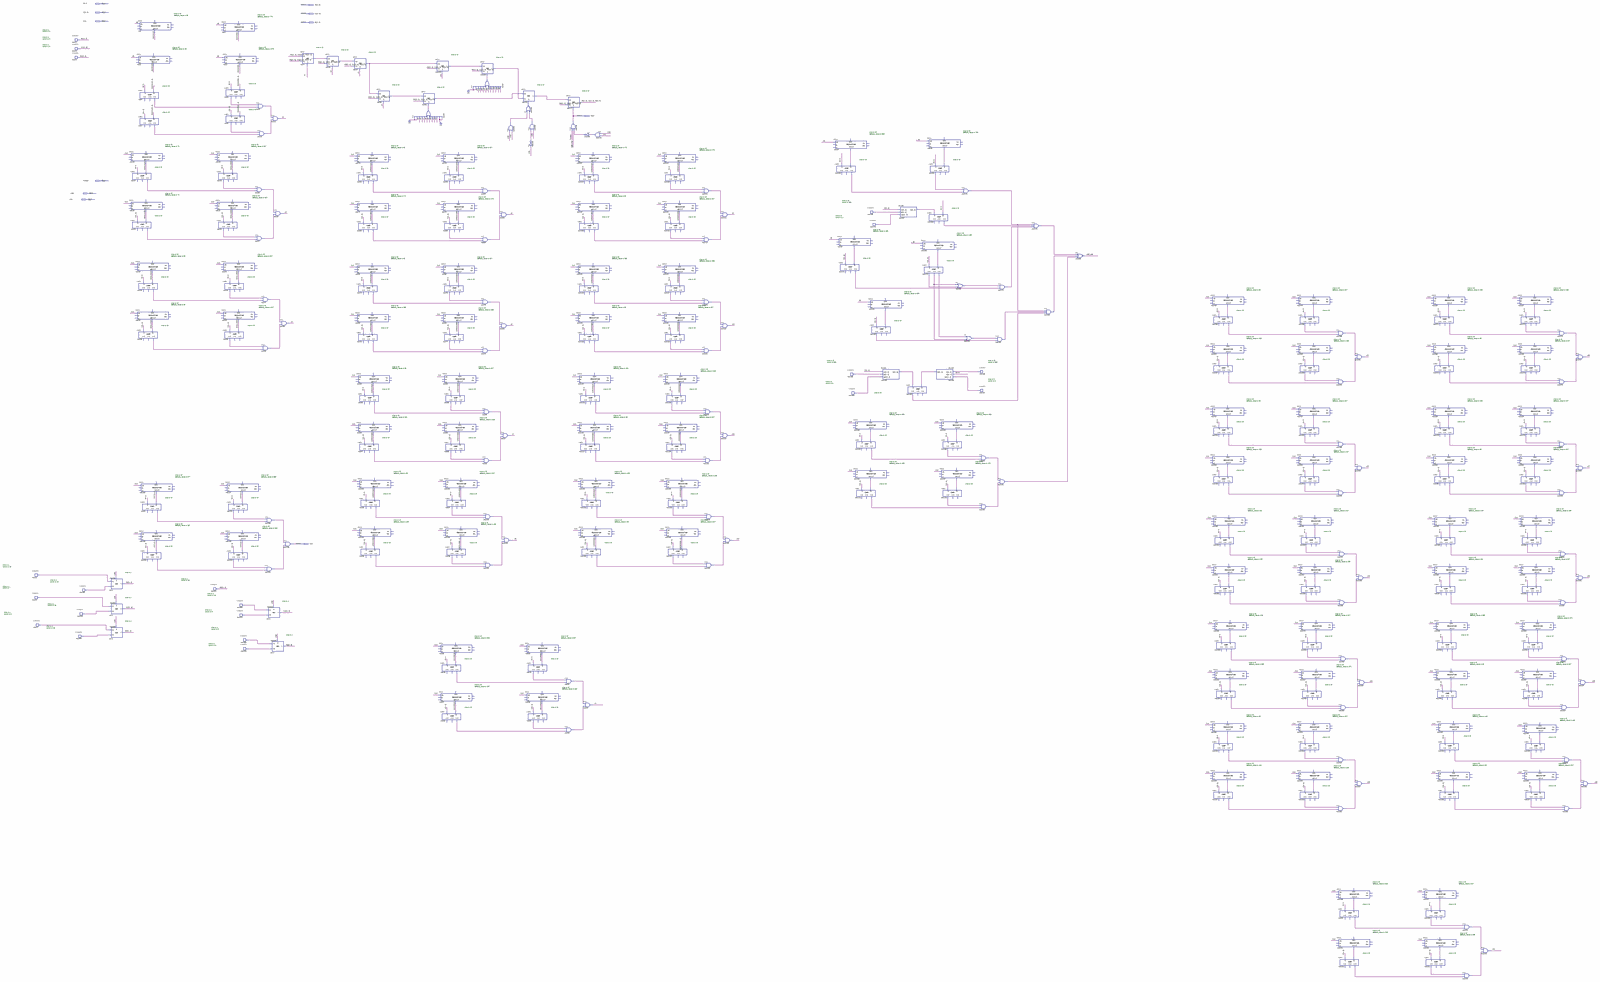
[diagram p0: schematic sheet, whole]
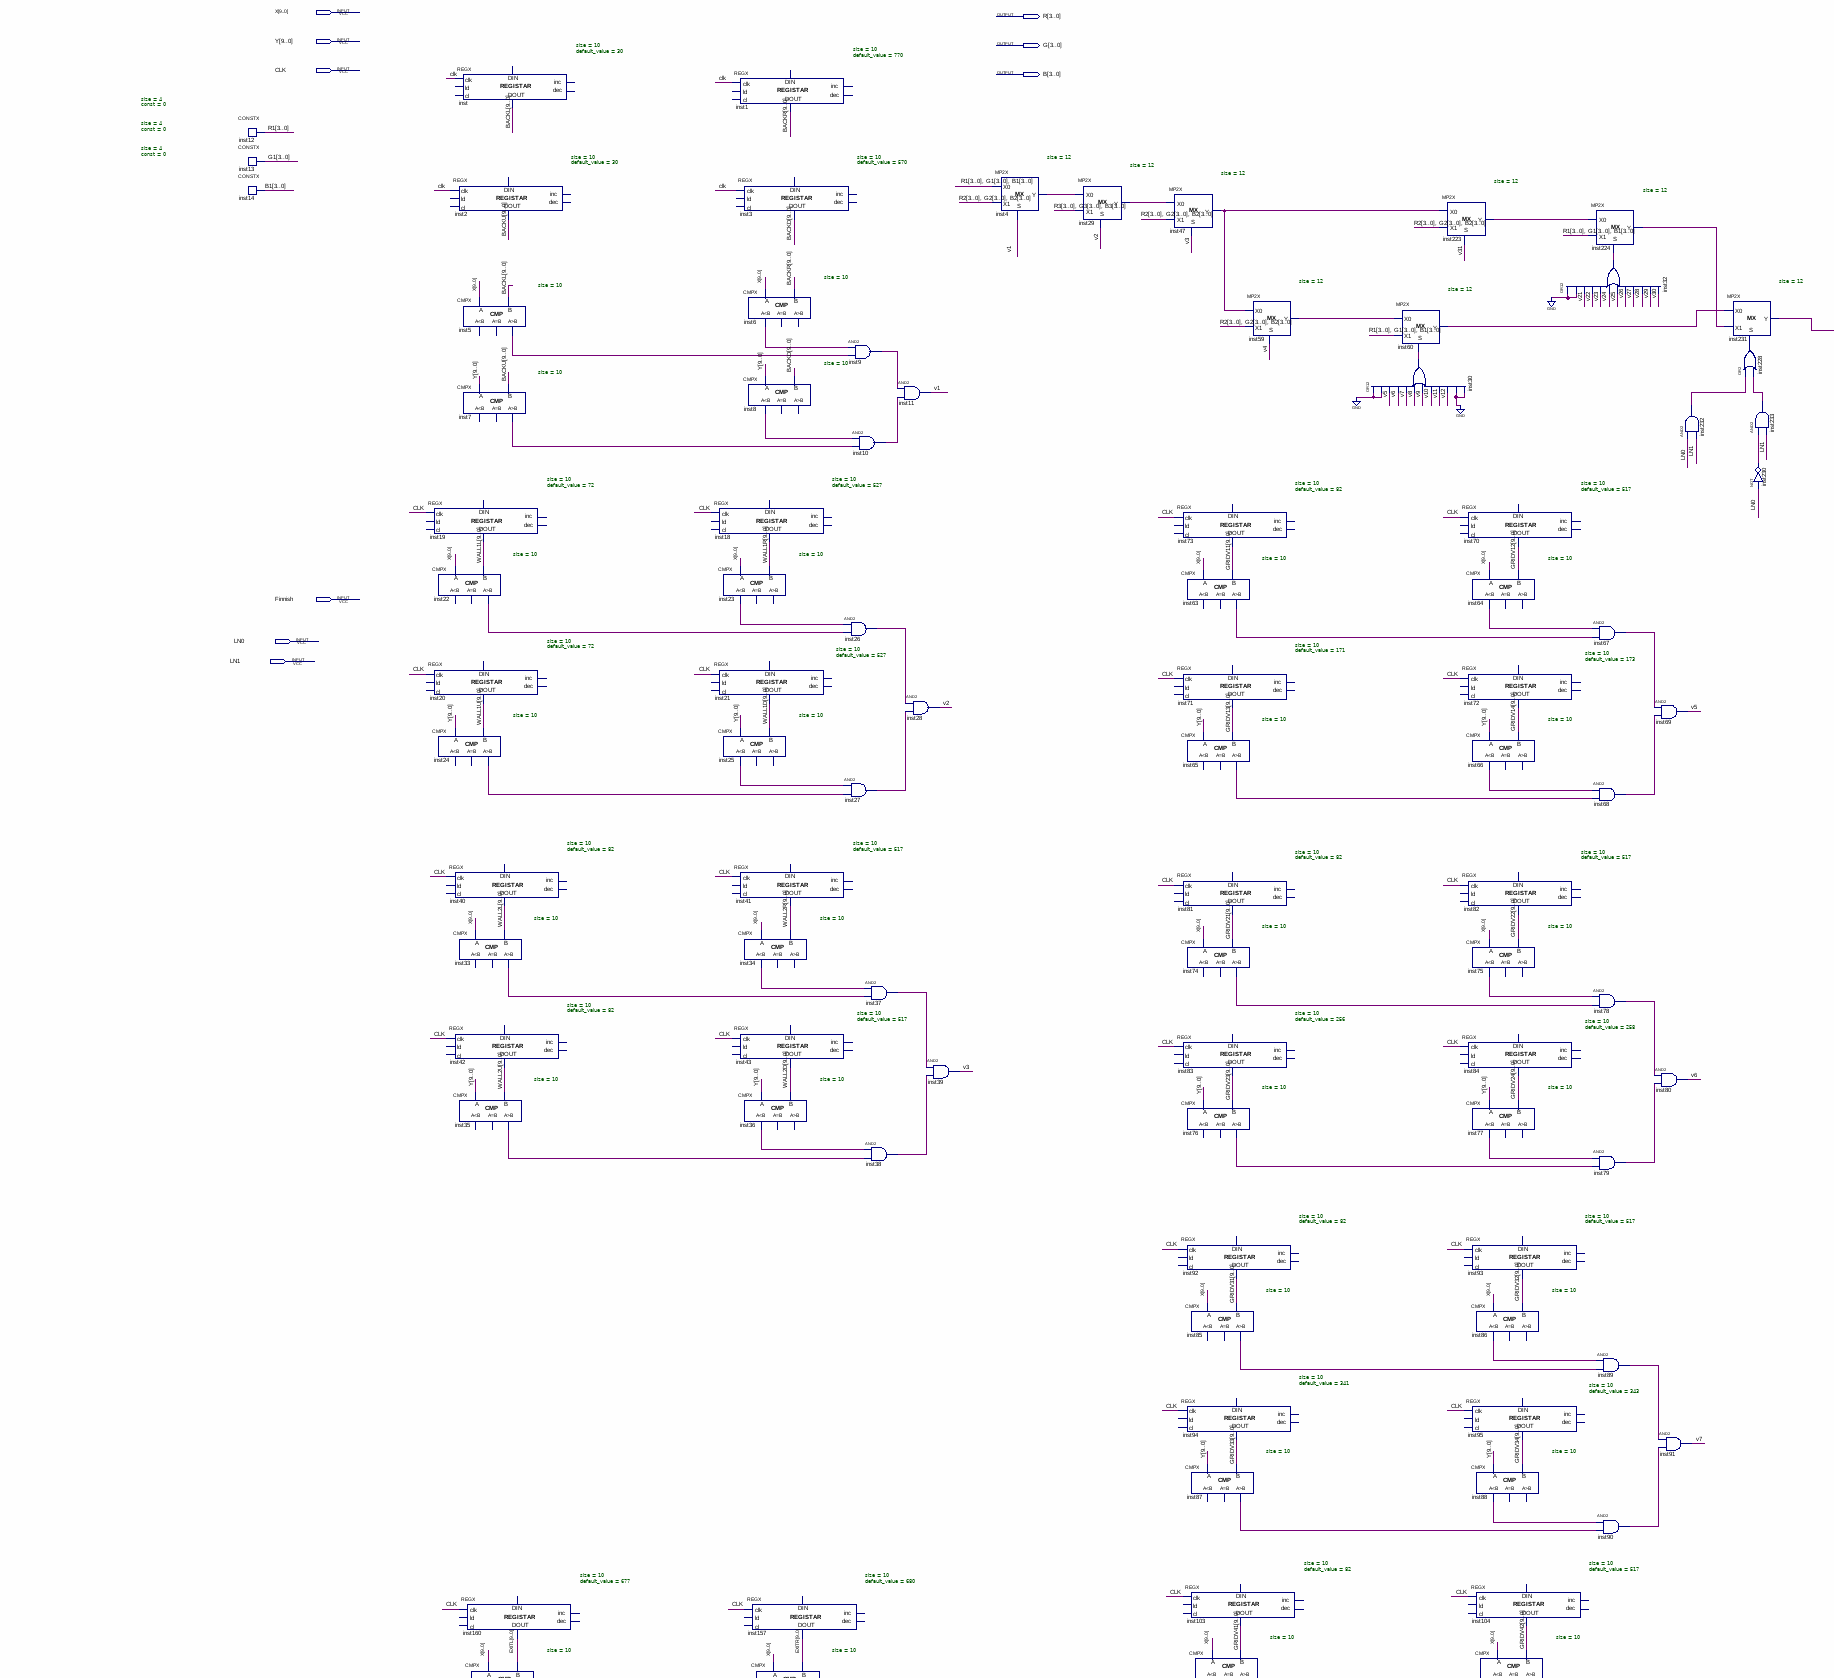
[diagram p1: schematic sheet, upper left part]
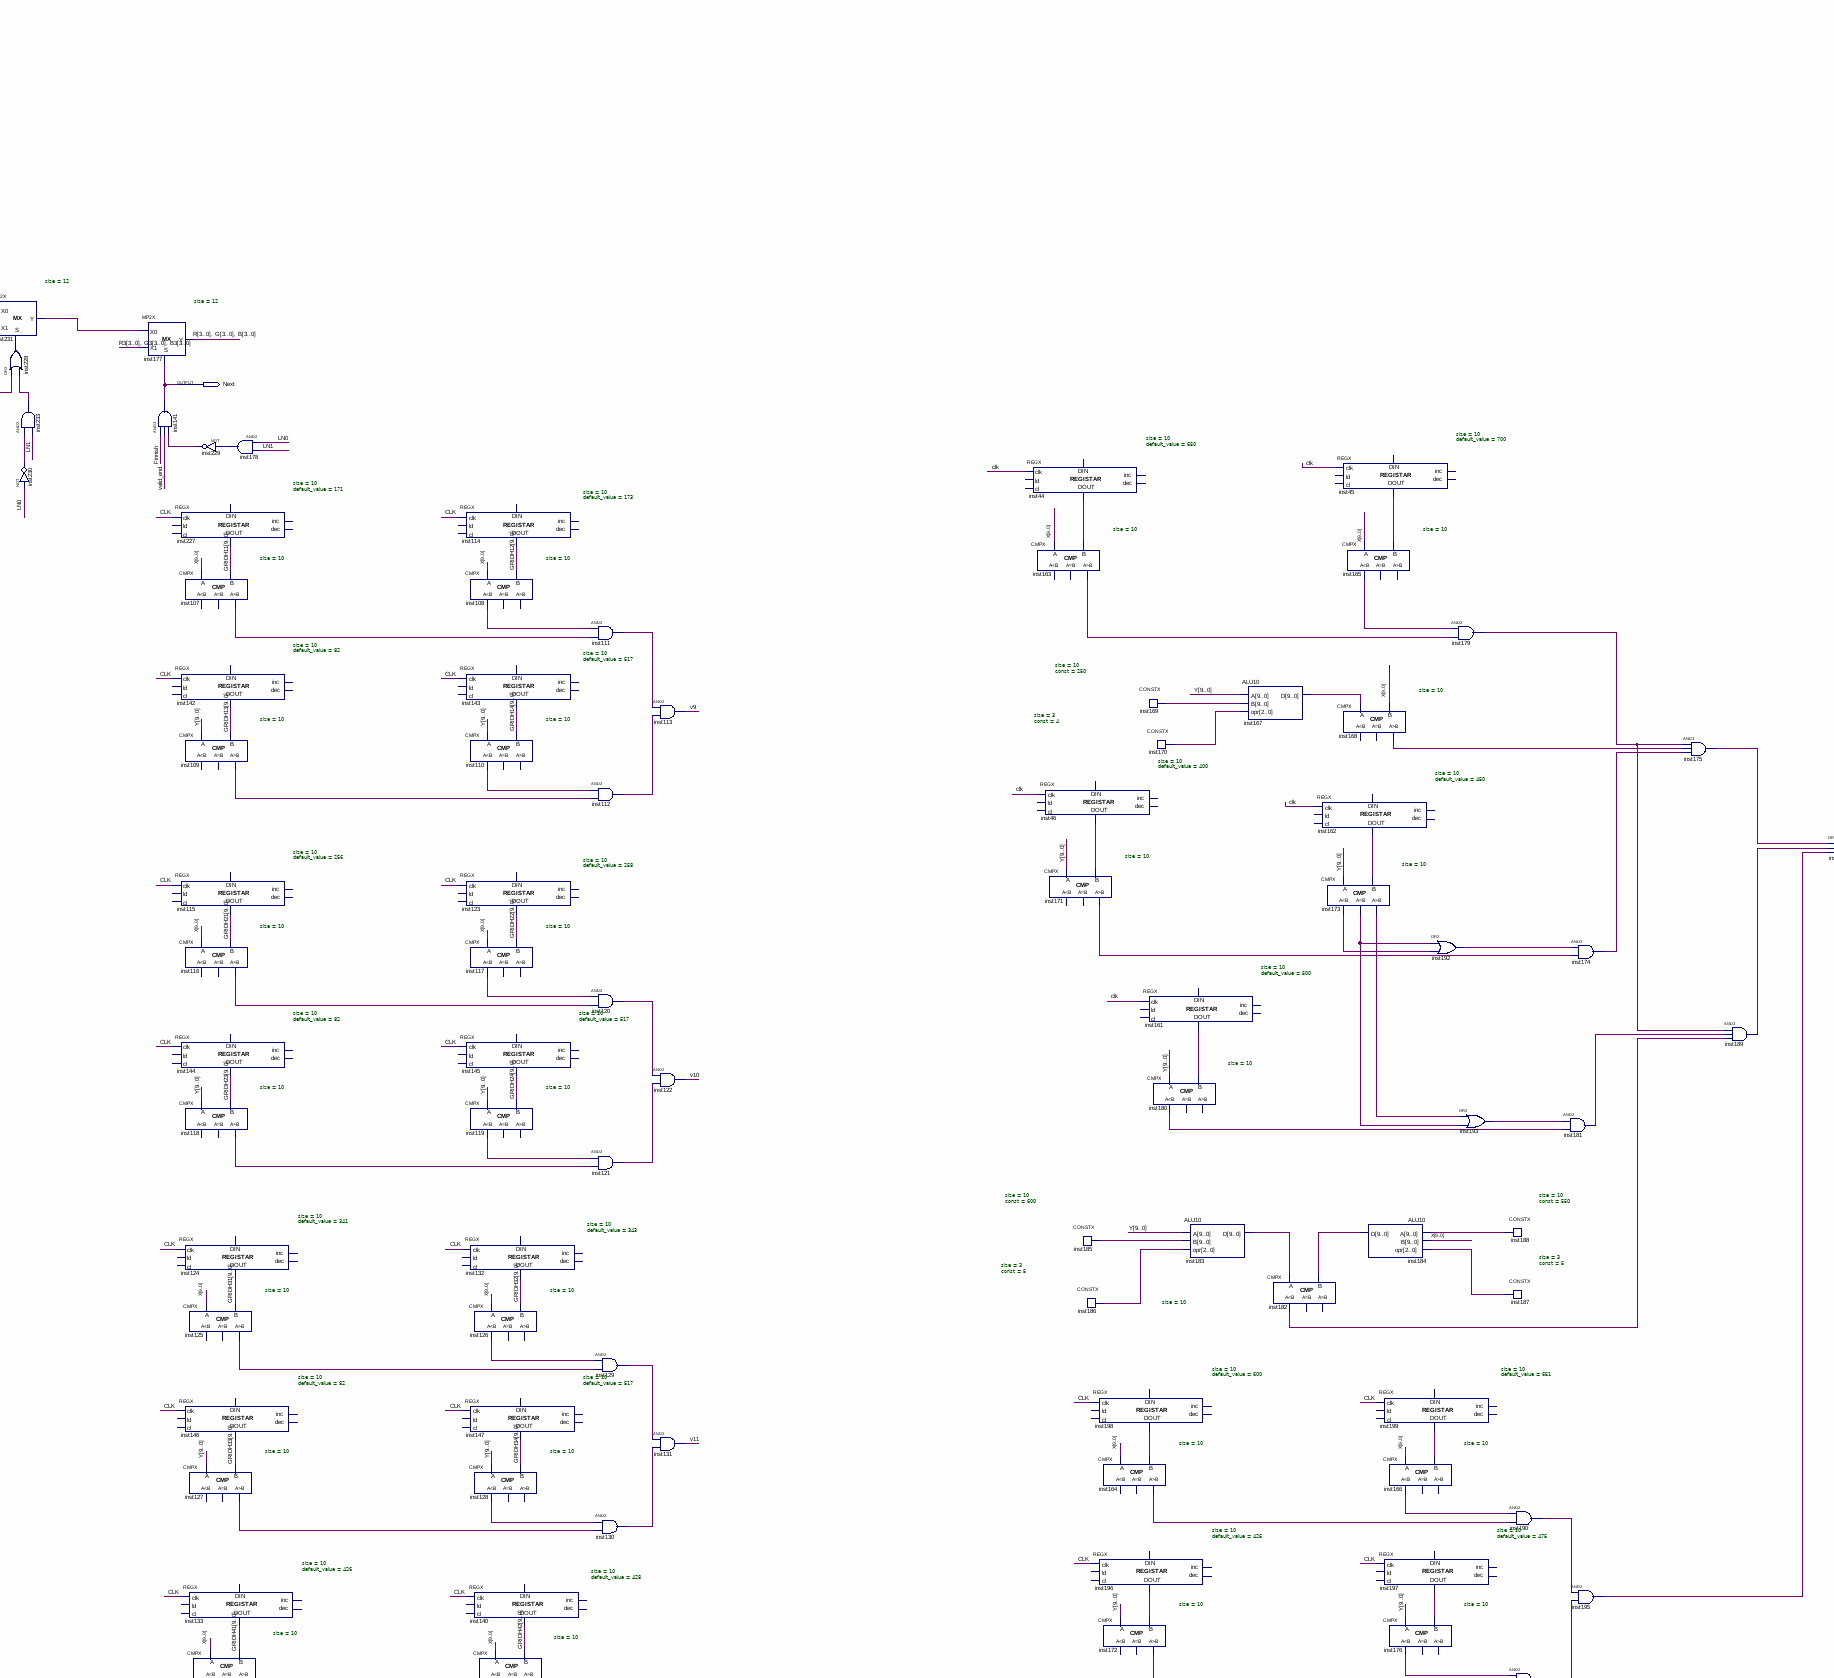
[diagram p2: schematic sheet, upper centre part]
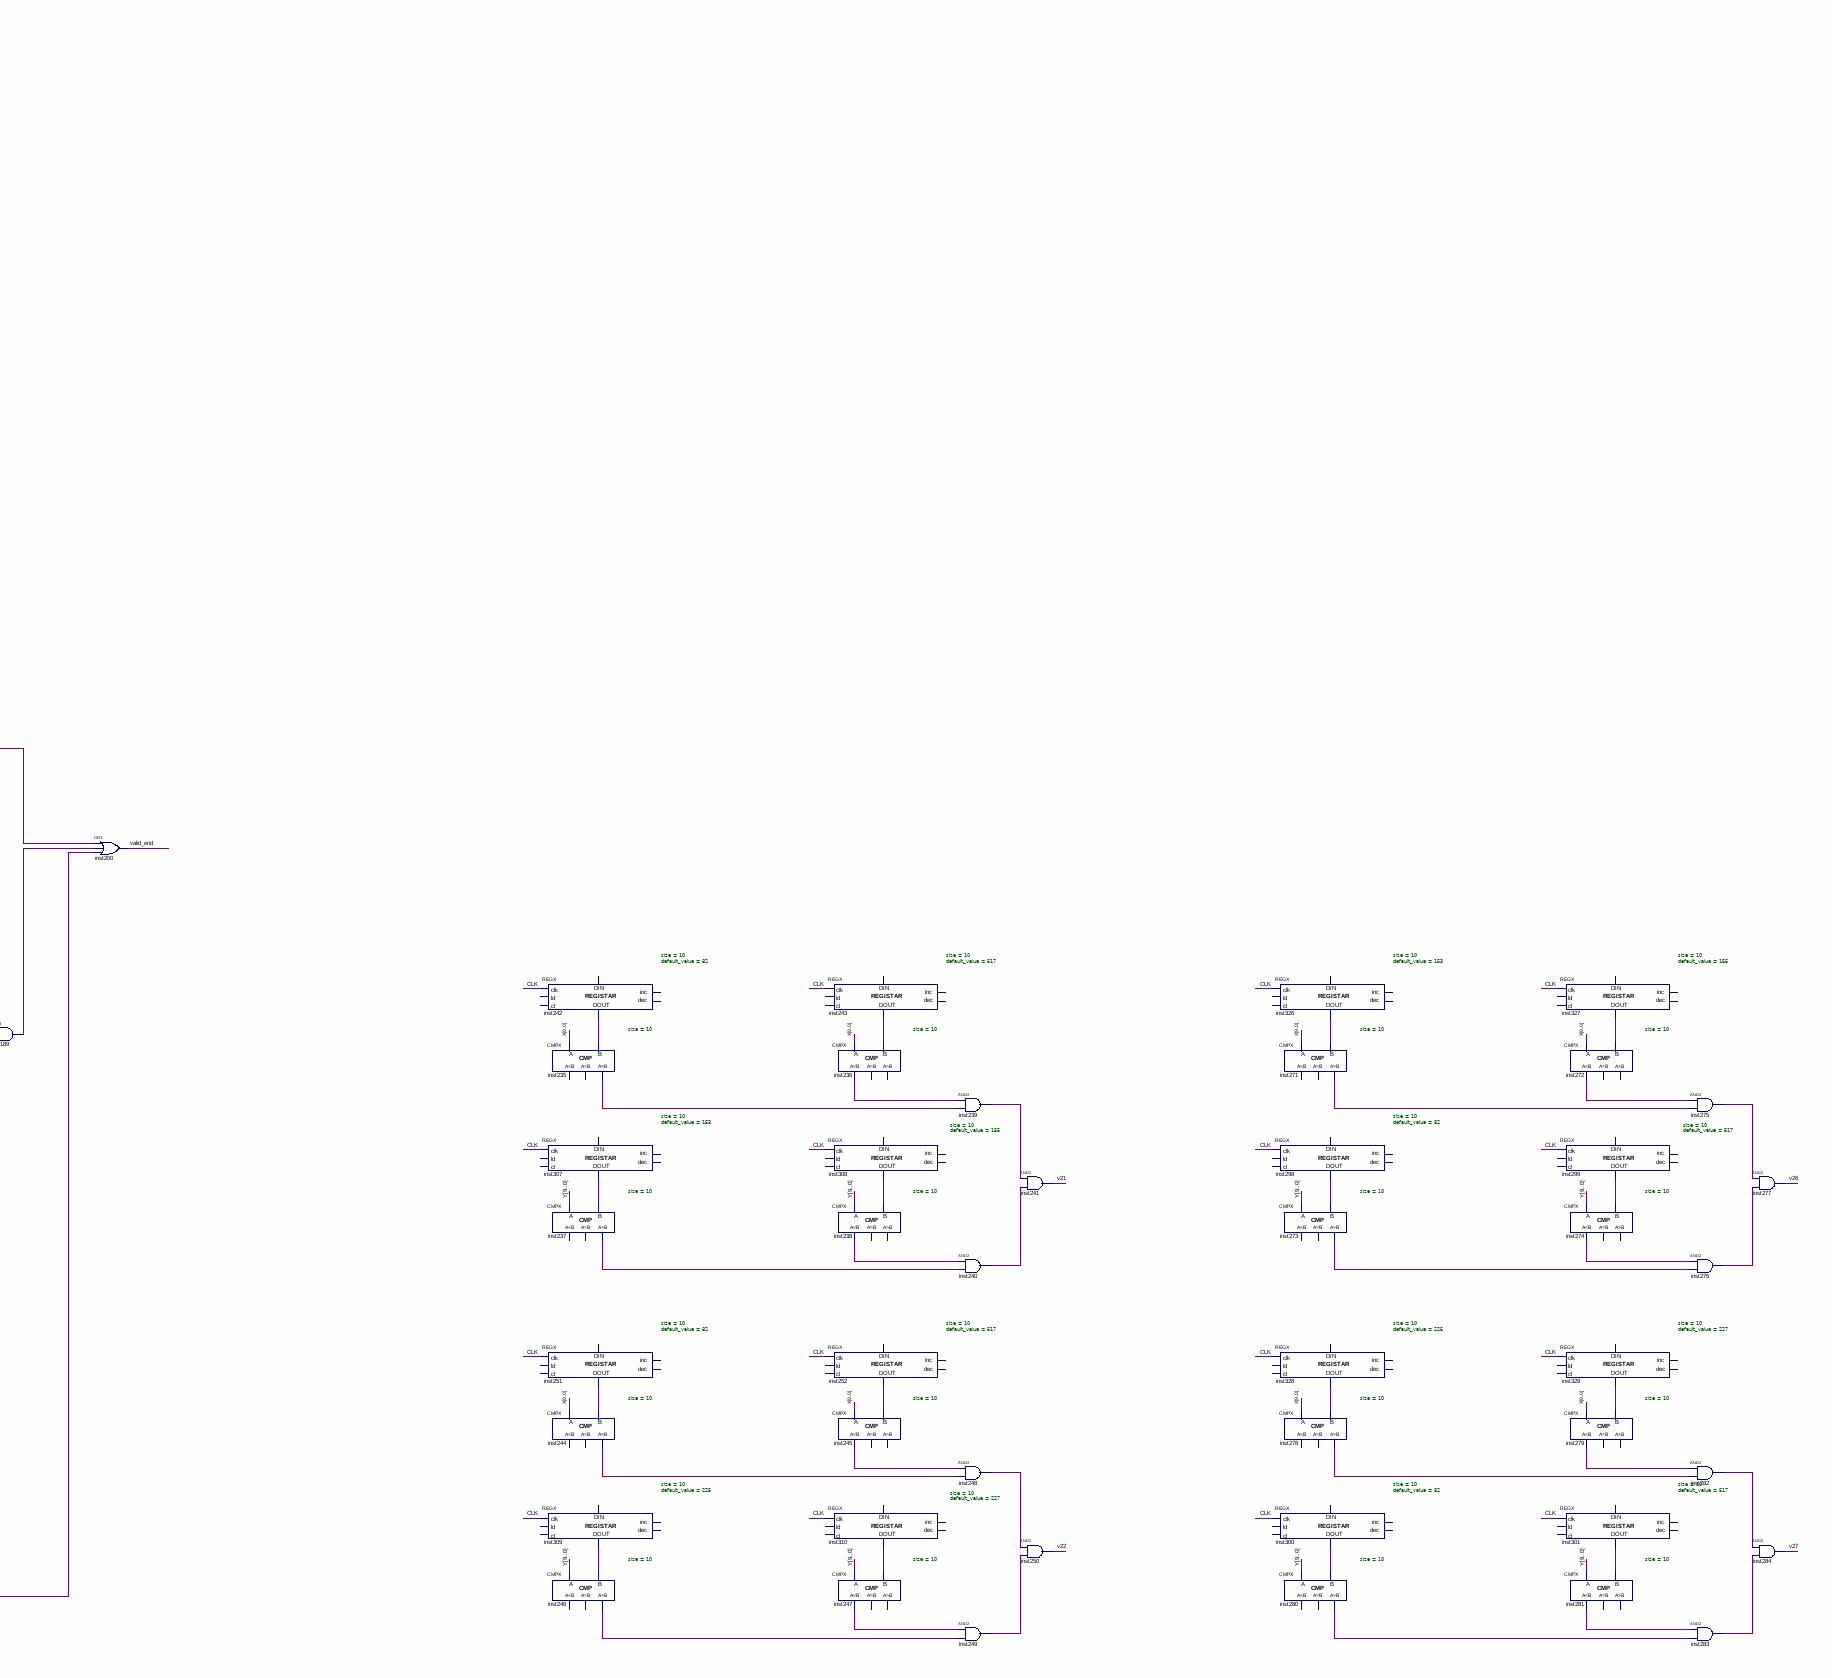
[diagram p3: schematic sheet, upper right part]
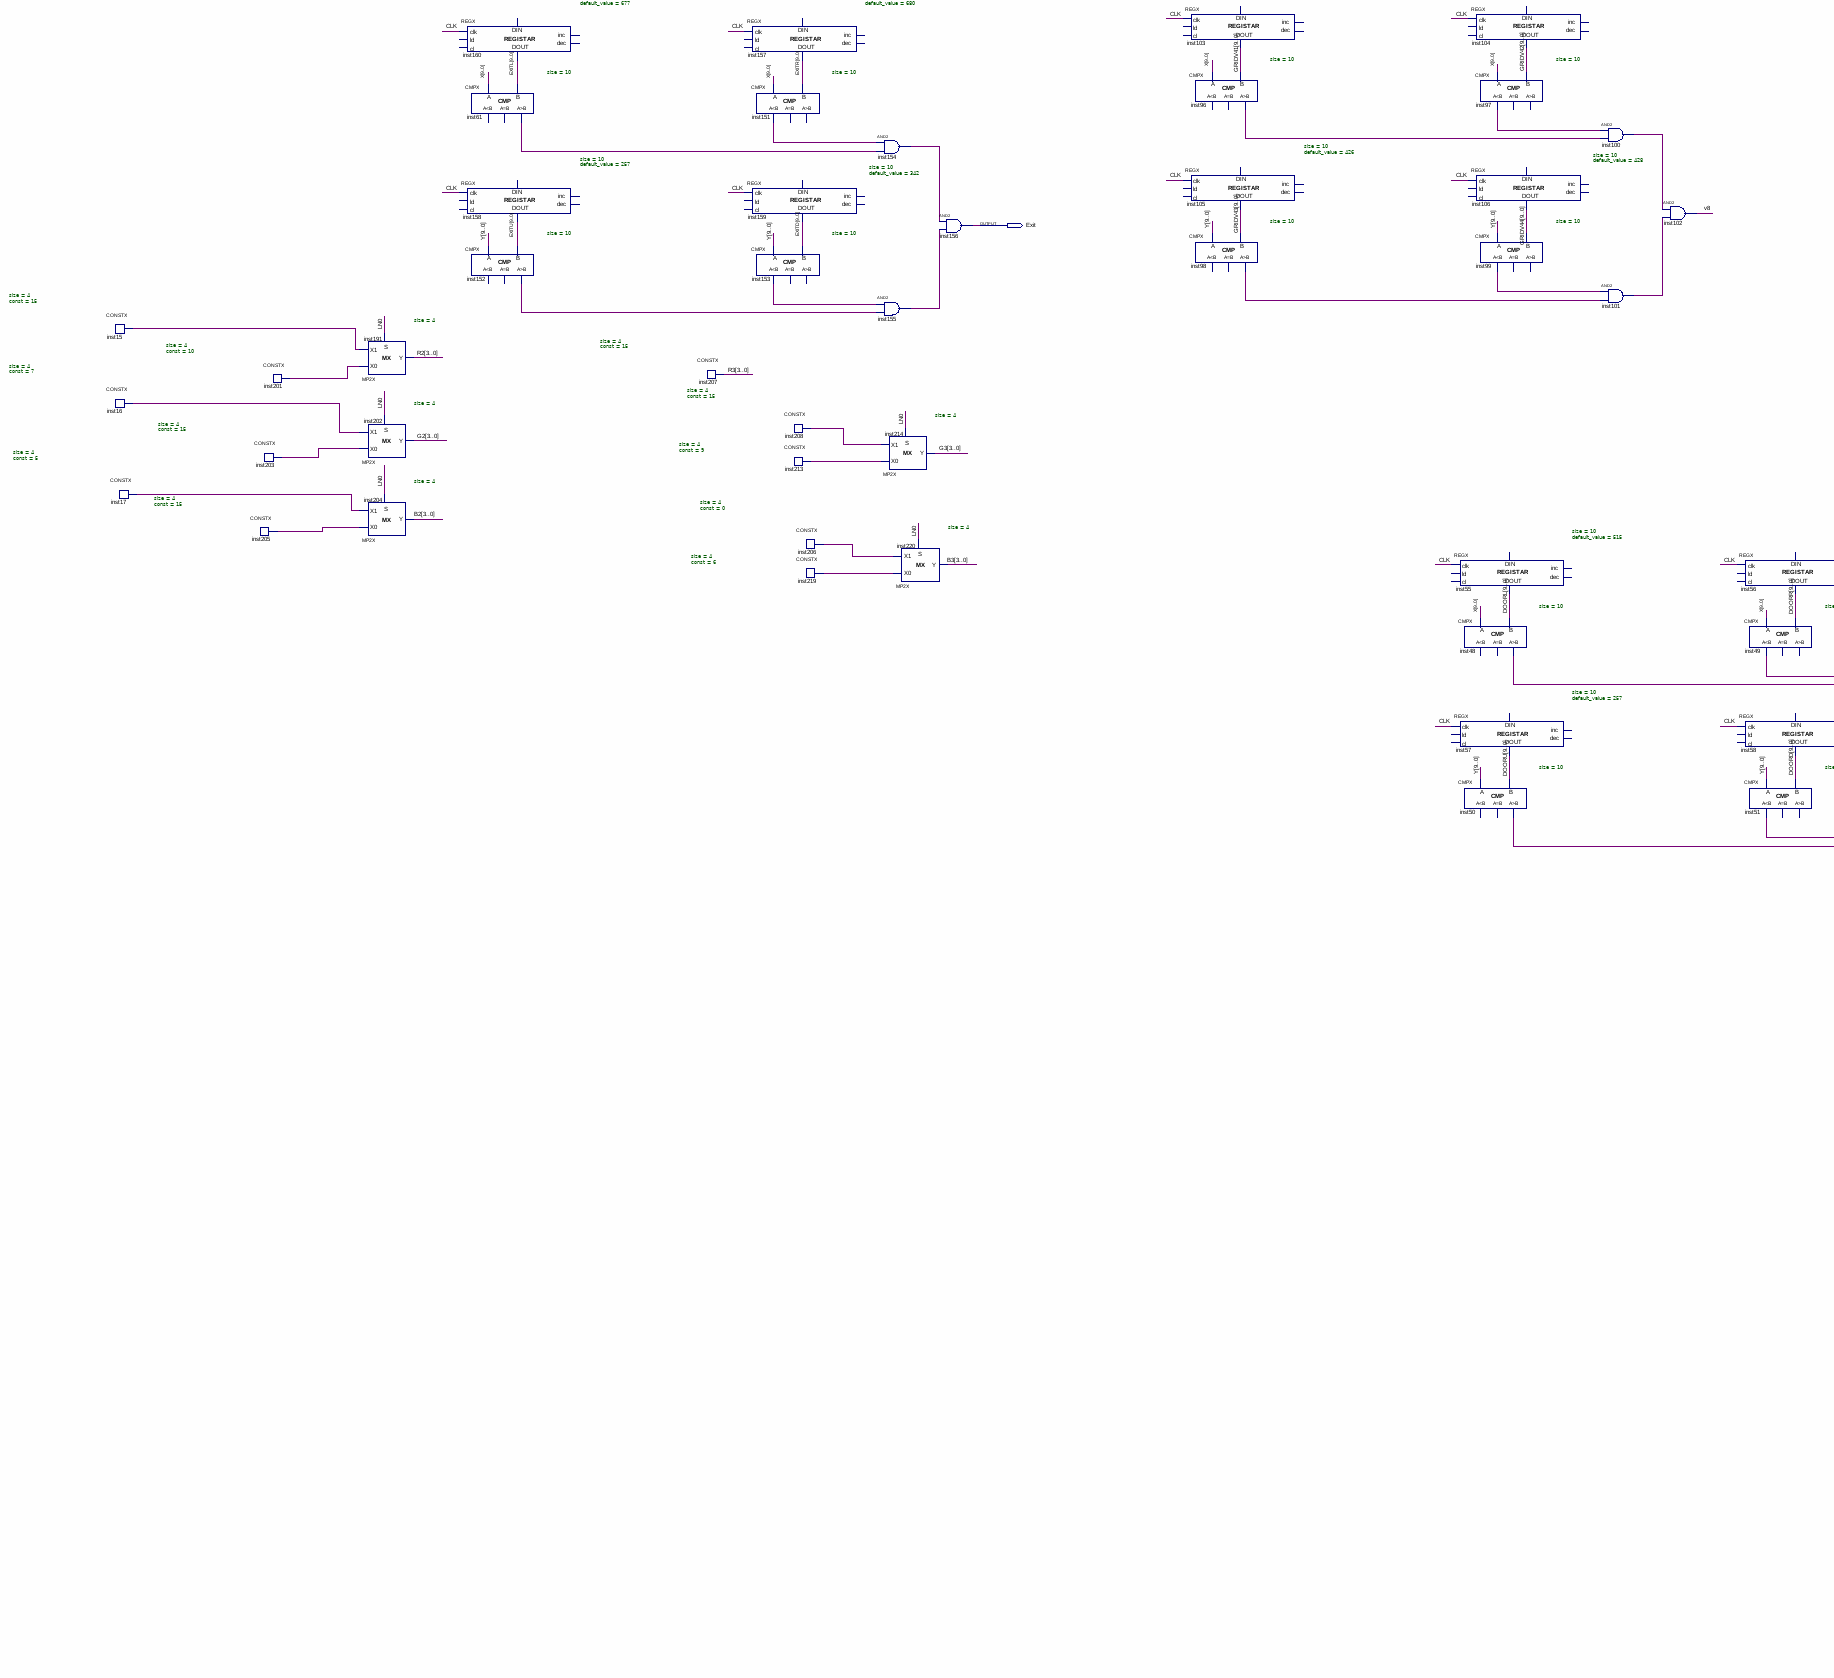
[diagram p4: schematic sheet, lower left part]
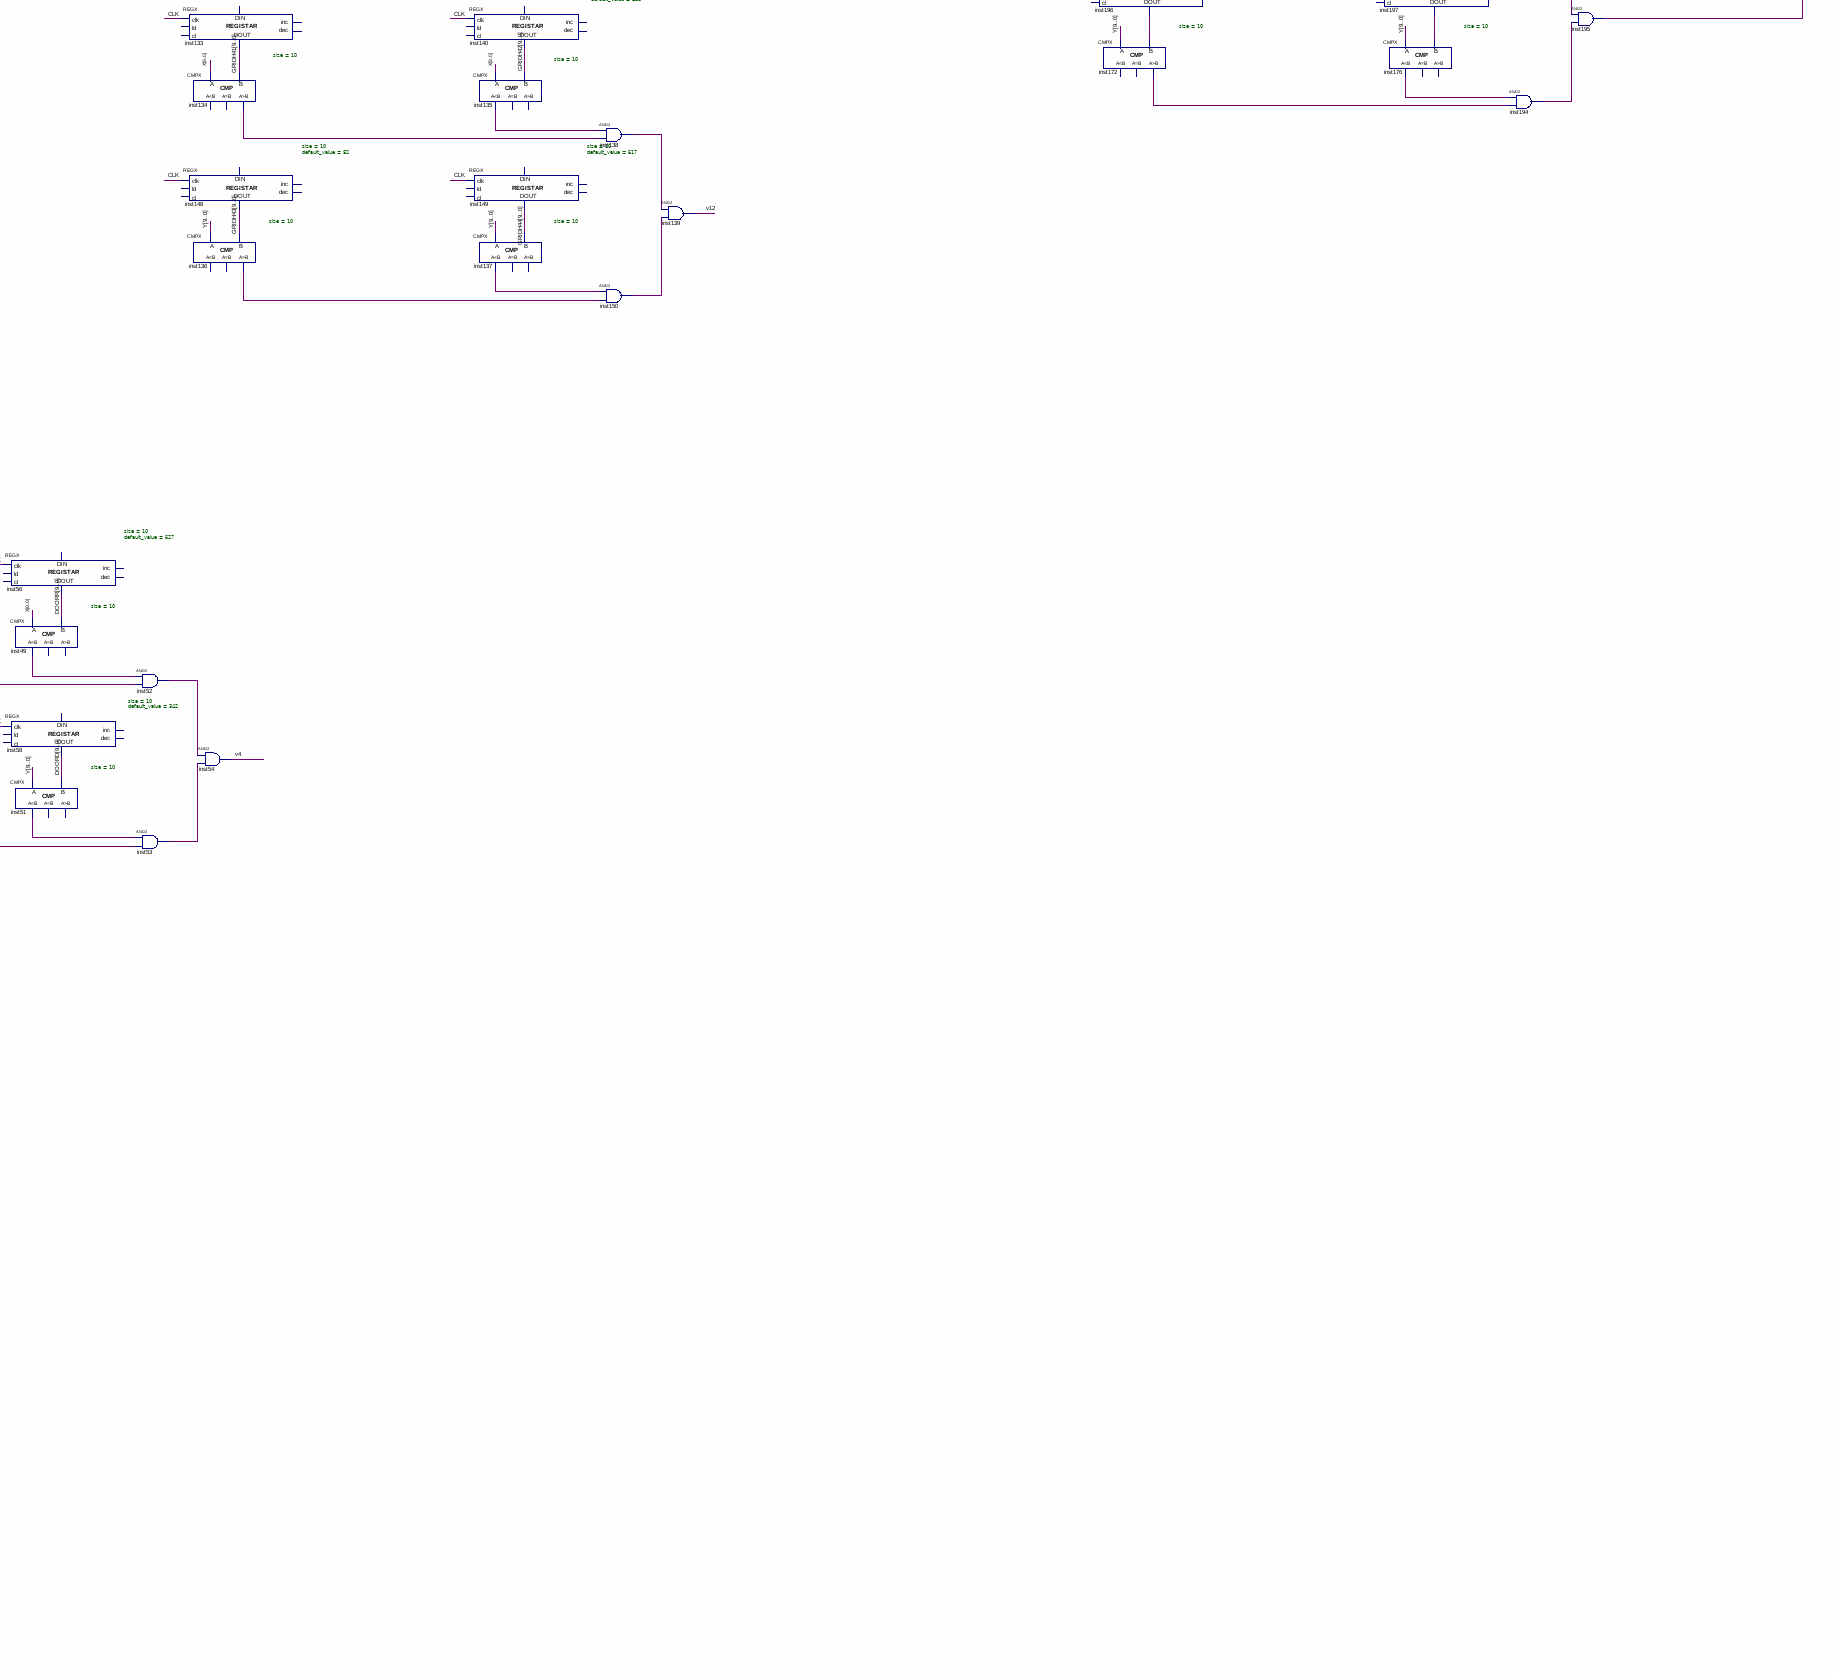
[diagram p5: schematic sheet, lower centre part]
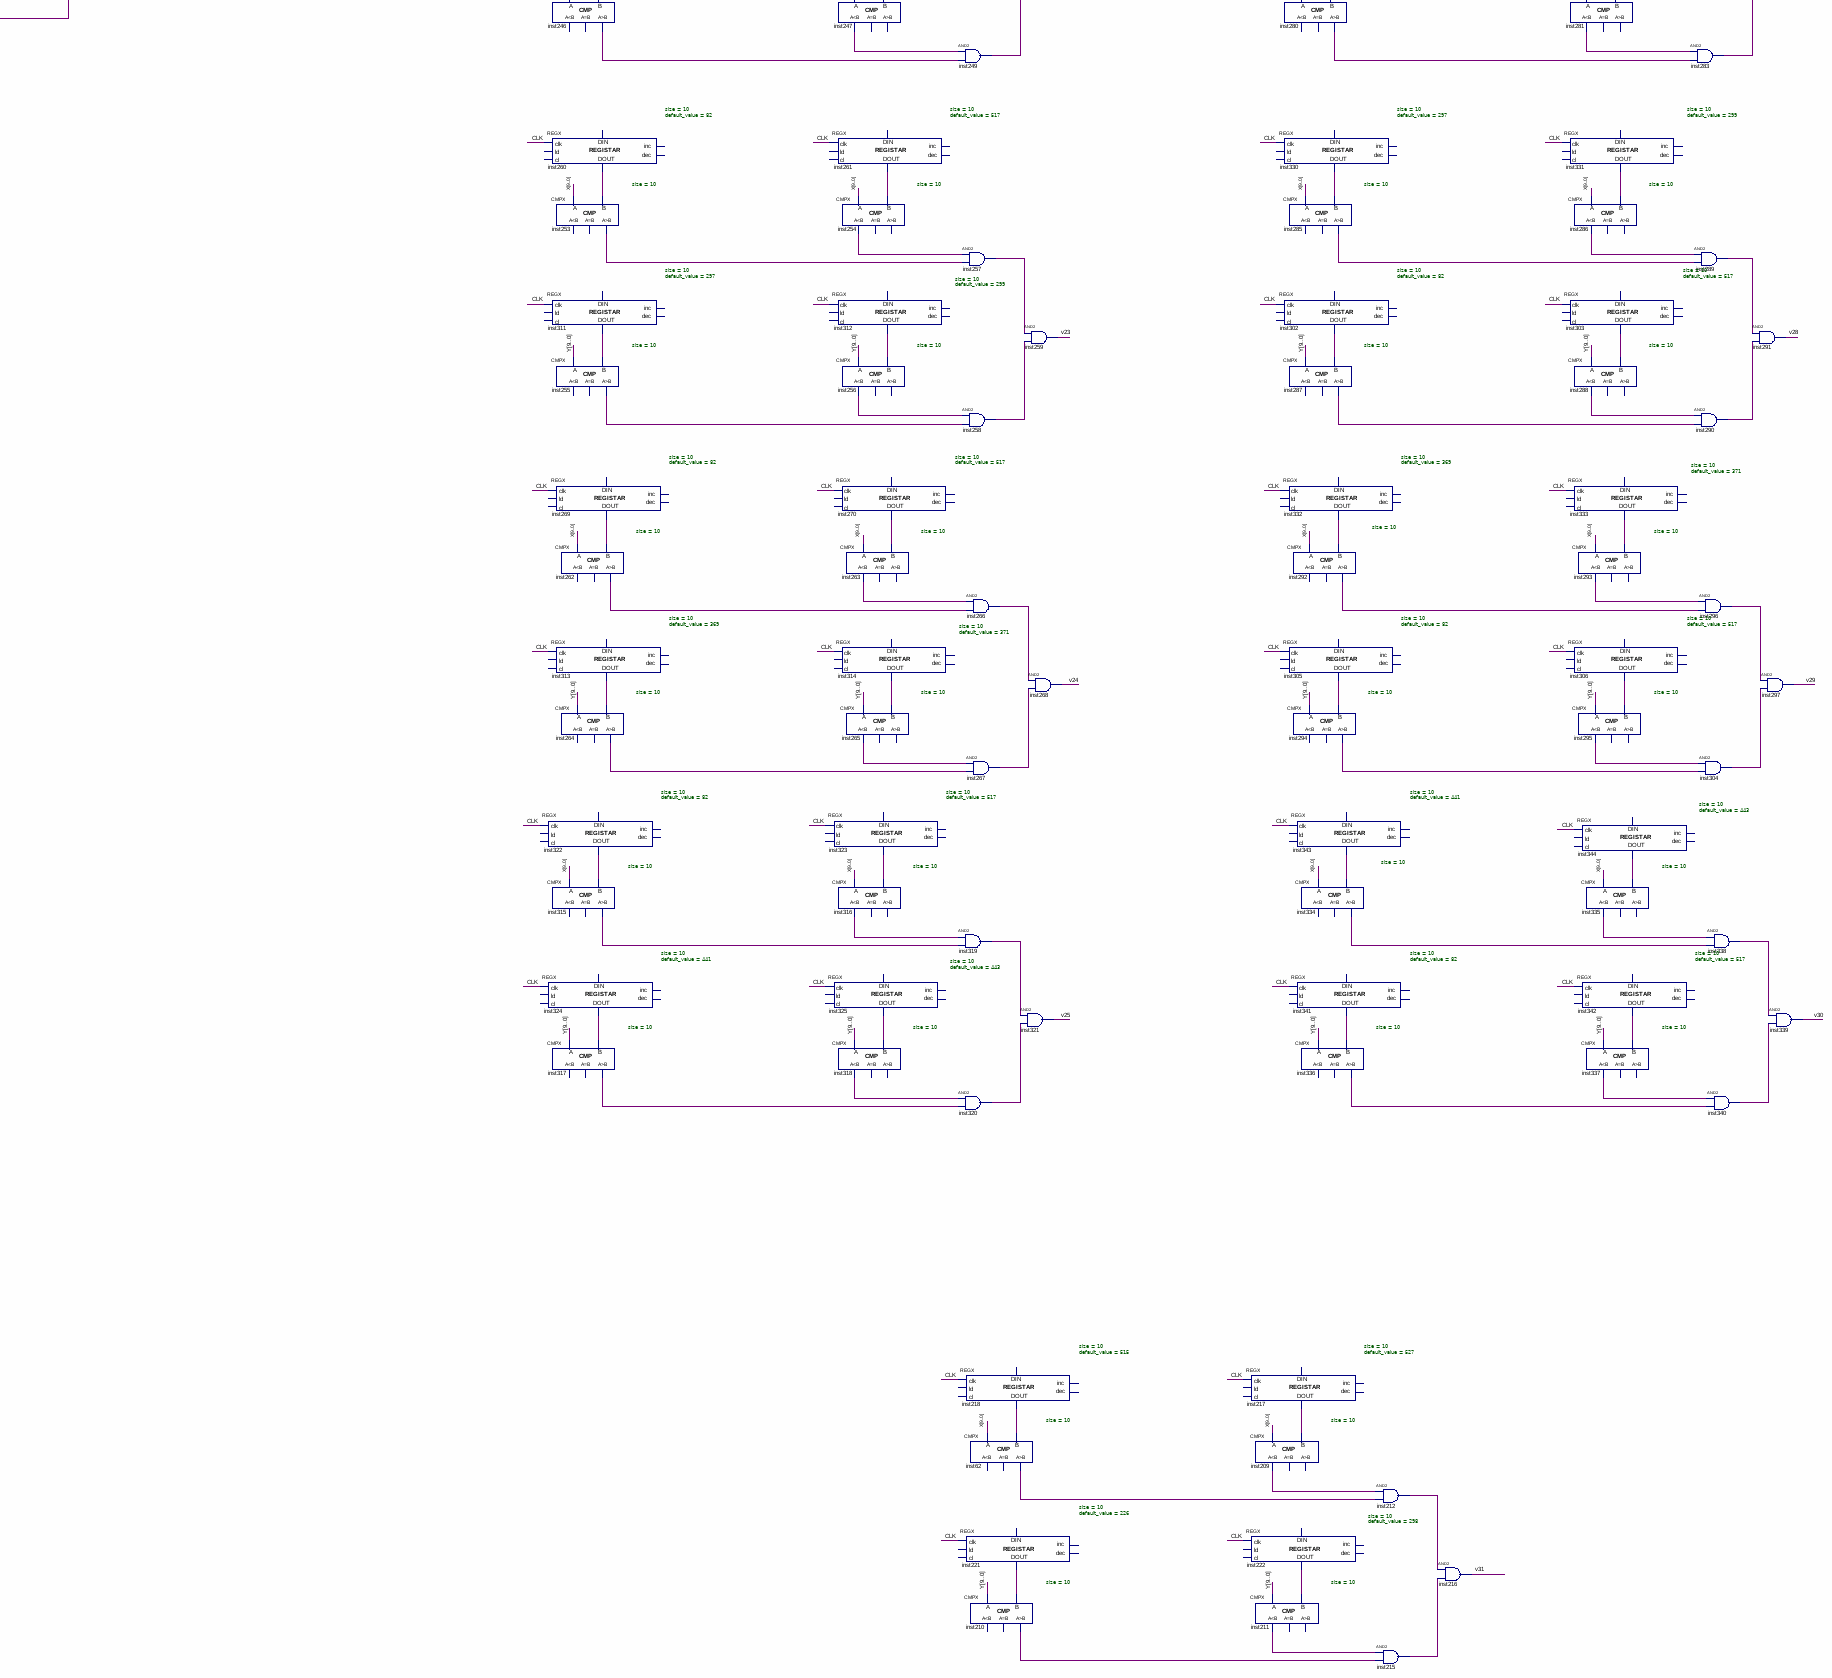
[diagram p6: schematic sheet, lower right part]
// Quartus schematic Back.bdf as structural Verilog: 341 symbols, 11 pins
module Back (
  input  [9:0] X,
  input  [9:0] Y,
  input  CLK,
  input  Finnish,
  input  LN0,
  input  LN1,
  output [3:0] R,
  output [3:0] G,
  output [3:0] B,
  output Next,
  output Exit
);

  wire inst5_gr, inst6_ls, inst7_gr, inst8_ls, inst9_out, inst10_out, inst22_gr, inst23_ls, inst24_gr,
       inst25_ls, inst26_out, inst27_out, inst30_out, inst32_out, inst33_gr, inst34_ls, inst35_gr, inst36_ls,
       inst37_out, inst38_out, inst48_gr, inst49_ls, inst50_gr, inst51_ls, inst52_out, inst53_out, inst61_gr,
       inst62_gr, inst63_gr, inst64_ls, inst65_gr, inst66_ls, inst67_out, inst68_out, inst74_gr, inst75_ls,
       inst76_gr, inst77_ls, inst78_out, inst79_out, inst85_gr, inst86_ls, inst87_gr, inst88_ls, inst89_out,
       inst90_out, inst96_gr, inst97_ls, inst98_gr, inst99_ls, inst100_out, inst101_out, inst107_gr,
       inst108_ls, inst109_gr, inst110_ls, inst111_out, inst112_out, inst116_gr, inst117_ls, inst118_gr,
       inst119_ls, inst120_out, inst121_out, inst125_gr, inst126_ls, inst127_gr, inst128_ls, inst129_out,
       inst130_out, inst134_gr, inst135_ls, inst136_gr, inst137_ls, inst138_out, inst150_out, inst151_ls,
       inst152_gr, inst153_ls, inst154_out, inst155_out, inst163_gr, inst164_gr, inst165_ls, inst166_ls,
       inst168_gr, inst171_gr, inst172_gr, inst173_eq, inst173_gr, inst173_ls, inst174_out, inst175_out,
       inst176_ls, inst178_out, inst179_out, inst180_ls, inst181_out, inst182_ls, inst189_out, inst190_out,
       inst192_out, inst193_out, inst194_out, inst195_out, inst209_ls, inst210_gr, inst211_ls, inst212_out,
       inst215_out, inst228_out, inst229_out, inst230_out, inst232_out, inst233_out, inst235_gr, inst236_ls,
       inst237_gr, inst238_ls, inst239_out, inst240_out, inst244_gr, inst245_ls, inst246_gr, inst247_ls,
       inst248_out, inst249_out, inst253_gr, inst254_ls, inst255_gr, inst256_ls, inst257_out, inst258_out,
       inst262_gr, inst263_ls, inst264_gr, inst265_ls, inst266_out, inst267_out, inst271_gr, inst272_ls,
       inst273_gr, inst274_ls, inst275_out, inst276_out, inst278_gr, inst279_ls, inst280_gr, inst281_ls,
       inst282_out, inst283_out, inst285_gr, inst286_ls, inst287_gr, inst288_ls, inst289_out, inst290_out,
       inst292_gr, inst293_ls, inst294_gr, inst295_ls, inst296_out, inst304_out, inst315_gr, inst316_ls,
       inst317_gr, inst318_ls, inst319_out, inst320_out, inst334_gr, inst335_ls, inst336_gr, inst337_ls,
       inst338_out, inst340_out, v1, v2, v3, v4, v5, v6, v7, v8, v9, v10, v11, v12, v21, v22, v23, v24, v25,
       v26, v27, v28, v29, v30, v31, valid_end;
  wire [2:0] inst170_data, inst186_data, inst187_data;
  wire [3:0] B1, B2, B3, G1, G2, G3, inst15_data, inst16_data, inst17_data, inst201_data, inst203_data,
       inst205_data, inst206_data, inst208_data, inst213_data, inst219_data, R1, R2, R3;
  wire [9:0] BACKD, BACKL, BACKR, BACKU, DOORD, DOORL, DOORR, DOORU, EXITD, EXITL, EXITR, EXITU, GRIDH11,
       GRIDH12, GRIDH13, GRIDH14, GRIDH21, GRIDH22, GRIDH23, GRIDH24, GRIDH31, GRIDH32, GRIDH33, GRIDH34,
       GRIDH41, GRIDH42, GRIDH43, GRIDH44, GRIDV11, GRIDV12, GRIDV13, GRIDV14, GRIDV21, GRIDV22, GRIDV23,
       GRIDV24, GRIDV31, GRIDV32, GRIDV33, GRIDV34, GRIDV41, GRIDV42, GRIDV43, GRIDV44, inst44_data_out,
       inst45_data_out, inst46_data_out, inst161_data_out, inst162_data_out, inst167_d, inst169_data,
       inst183_d, inst184_d, inst185_data, inst188_data, inst196_data_out, inst197_data_out,
       inst198_data_out, inst199_data_out, inst217_data_out, inst218_data_out, inst221_data_out,
       inst222_data_out, inst242_data_out, inst243_data_out, inst251_data_out, inst252_data_out,
       inst260_data_out, inst261_data_out, inst269_data_out, inst270_data_out, inst298_data_out,
       inst299_data_out, inst300_data_out, inst301_data_out, inst302_data_out, inst303_data_out,
       inst305_data_out, inst306_data_out, inst307_data_out, inst308_data_out, inst309_data_out,
       inst310_data_out, inst311_data_out, inst312_data_out, inst313_data_out, inst314_data_out,
       inst322_data_out, inst323_data_out, inst324_data_out, inst325_data_out, inst326_data_out,
       inst327_data_out, inst328_data_out, inst329_data_out, inst330_data_out, inst331_data_out,
       inst332_data_out, inst333_data_out, inst341_data_out, inst342_data_out, inst343_data_out,
       inst344_data_out, WALL1D, WALL1L, WALL1R, WALL1U, WALL2D, WALL2L, WALL2R, WALL2U;
  wire [11:0] inst4_y, inst29_y, inst47_y, inst59_y, inst60_y, inst223_y, inst224_y, inst231_y;

  CONSTX #(.size(4), .\const (15)) inst15 (.data(inst15_data));
  CONSTX #(.size(4), .\const (7)) inst16 (.data(inst16_data));
  CONSTX #(.size(4), .\const (5)) inst17 (.data(inst17_data));
  CONSTX #(.size(4), .\const (0)) inst12 (.data(R1));
  CONSTX #(.size(4), .\const (0)) inst13 (.data(G1));
  CONSTX #(.size(4), .\const (0)) inst14 (.data(B1));
  CONSTX #(.size(4), .\const (10)) inst201 (.data(inst201_data));
  CONSTX #(.size(4), .\const (15)) inst203 (.data(inst203_data));
  CONSTX #(.size(4), .\const (15)) inst205 (.data(inst205_data));
  MP2X #(.size(4)) inst191 (.S(LN0), .X0(inst201_data), .X1(inst15_data), .Y(R2));
  MP2X #(.size(4)) inst202 (.S(LN0), .X0(inst203_data), .X1(inst16_data), .Y(G2));
  MP2X #(.size(4)) inst204 (.S(LN0), .X0(inst205_data), .X1(inst17_data), .Y(B2));
  REGX #(.size(10), .default_value(72)) inst19 (.clk(CLK), .data_out(WALL1L));  // open: ld, cl, inc, dec, data_in
  CMPX #(.size(10)) inst22 (.A(X), .B(WALL1L), .gr(inst22_gr));  // open: ls, eq
  REGX #(.size(10), .default_value(72)) inst20 (.clk(CLK), .data_out(WALL1U));  // open: ld, cl, inc, dec, data_in
  CMPX #(.size(10)) inst24 (.A(Y), .B(WALL1U), .gr(inst24_gr));  // open: ls, eq
  REGX #(.size(10), .default_value(30)) inst (.clk(CLK), .data_out(BACKL));  // open: ld, cl, inc, dec, data_in
  REGX #(.size(10), .default_value(30)) inst2 (.clk(CLK), .data_out(BACKU));  // open: ld, cl, inc, dec, data_in
  CMPX #(.size(10)) inst5 (.A(X), .B(BACKL), .gr(inst5_gr));  // open: ls, eq
  CMPX #(.size(10)) inst7 (.A(Y), .B(BACKU), .gr(inst7_gr));  // open: ls, eq
  REGX #(.size(10), .default_value(82)) inst40 (.clk(CLK), .data_out(WALL2L));  // open: ld, cl, inc, dec, data_in
  CMPX #(.size(10)) inst33 (.A(X), .B(WALL2L), .gr(inst33_gr));  // open: ls, eq
  REGX #(.size(10), .default_value(82)) inst42 (.clk(CLK), .data_out(WALL2U));  // open: ld, cl, inc, dec, data_in
  CMPX #(.size(10)) inst35 (.A(Y), .B(WALL2U), .gr(inst35_gr));  // open: ls, eq
  REGX #(.size(10), .default_value(677)) inst160 (.clk(CLK), .data_out(EXITL));  // open: ld, cl, inc, dec, data_in
  CMPX #(.size(10)) inst61 (.A(X), .B(EXITL), .gr(inst61_gr));  // open: ls, eq
  REGX #(.size(10), .default_value(257)) inst158 (.clk(CLK), .data_out(EXITU));  // open: ld, cl, inc, dec, data_in
  CMPX #(.size(10)) inst152 (.A(Y), .B(EXITU), .gr(inst152_gr));  // open: ls, eq
  CONSTX #(.size(4), .\const (15)) inst207 (.data(R3));
  REGX #(.size(10), .default_value(527)) inst18 (.clk(CLK), .data_out(WALL1R));  // open: ld, cl, inc, dec, data_in
  CMPX #(.size(10)) inst23 (.A(X), .B(WALL1R), .ls(inst23_ls));  // open: eq, gr
  REGX #(.size(10), .default_value(527)) inst21 (.clk(CLK), .data_out(WALL1D));  // open: ld, cl, inc, dec, data_in
  CMPX #(.size(10)) inst25 (.A(Y), .B(WALL1D), .ls(inst25_ls));  // open: eq, gr
  REGX #(.size(10), .default_value(770)) inst1 (.clk(CLK), .data_out(BACKR));  // open: ld, cl, inc, dec, data_in
  REGX #(.size(10), .default_value(570)) inst3 (.clk(CLK), .data_out(BACKD));  // open: ld, cl, inc, dec, data_in
  CMPX #(.size(10)) inst6 (.A(X), .B(BACKR), .ls(inst6_ls));  // open: eq, gr
  CMPX #(.size(10)) inst8 (.A(Y), .B(BACKD), .ls(inst8_ls));  // open: eq, gr
  REGX #(.size(10), .default_value(517)) inst41 (.clk(CLK), .data_out(WALL2R));  // open: ld, cl, inc, dec, data_in
  CMPX #(.size(10)) inst34 (.A(X), .B(WALL2R), .ls(inst34_ls));  // open: eq, gr
  REGX #(.size(10), .default_value(517)) inst43 (.clk(CLK), .data_out(WALL2D));  // open: ld, cl, inc, dec, data_in
  CMPX #(.size(10)) inst36 (.A(Y), .B(WALL2D), .ls(inst36_ls));  // open: eq, gr
  REGX #(.size(10), .default_value(680)) inst157 (.clk(CLK), .data_out(EXITR));  // open: ld, cl, inc, dec, data_in
  CMPX #(.size(10)) inst151 (.A(X), .B(EXITR), .ls(inst151_ls));  // open: eq, gr
  REGX #(.size(10), .default_value(342)) inst159 (.clk(CLK), .data_out(EXITD));  // open: ld, cl, inc, dec, data_in
  CMPX #(.size(10)) inst153 (.A(Y), .B(EXITD), .ls(inst153_ls));  // open: eq, gr
  CONSTX #(.size(4), .\const (15)) inst208 (.data(inst208_data));
  CONSTX #(.size(4), .\const (9)) inst213 (.data(inst213_data));
  CONSTX #(.size(4), .\const (0)) inst206 (.data(inst206_data));
  CONSTX #(.size(4), .\const (6)) inst219 (.data(inst219_data));
  and inst9 (inst9_out, inst6_ls, inst5_gr);
  and inst10 (inst10_out, inst8_ls, inst7_gr);
  and inst26 (inst26_out, inst23_ls, inst22_gr);
  and inst27 (inst27_out, inst25_ls, inst24_gr);
  and inst37 (inst37_out, inst34_ls, inst33_gr);
  and inst38 (inst38_out, inst36_ls, inst35_gr);
  and inst154 (inst154_out, inst151_ls, inst61_gr);
  and inst155 (inst155_out, inst153_ls, inst152_gr);
  MP2X #(.size(4)) inst214 (.S(LN0), .X0(inst213_data), .X1(inst208_data), .Y(G3));
  MP2X #(.size(4)) inst220 (.S(LN0), .X0(inst219_data), .X1(inst206_data), .Y(B3));
  and inst11 (v1, inst9_out, inst10_out);
  and inst28 (v2, inst26_out, inst27_out);
  and inst39 (v3, inst37_out, inst38_out);
  and inst156 (Exit, inst154_out, inst155_out);
  MP2X #(.size(12)) inst4 (.S(v1), .X0({R1, G1, B1}), .X1({R2, G2, B2}), .Y(inst4_y));
  MP2X #(.size(12)) inst29 (.S(v2), .X0(inst4_y), .X1({R3, G3, B3}), .Y(inst29_y));
  MP2X #(.size(12)) inst47 (.S(v3), .X0(inst29_y), .X1({R2, G2, B2}), .Y(inst47_y));
  REGX #(.size(10), .default_value(82)) inst73 (.clk(CLK), .data_out(GRIDV11));  // open: ld, cl, inc, dec, data_in
  CMPX #(.size(10)) inst63 (.A(X), .B(GRIDV11), .gr(inst63_gr));  // open: ls, eq
  REGX #(.size(10), .default_value(171)) inst71 (.clk(CLK), .data_out(GRIDV13));  // open: ld, cl, inc, dec, data_in
  CMPX #(.size(10)) inst65 (.A(Y), .B(GRIDV13), .gr(inst65_gr));  // open: ls, eq
  REGX #(.size(10), .default_value(82)) inst81 (.clk(CLK), .data_out(GRIDV21));  // open: ld, cl, inc, dec, data_in
  CMPX #(.size(10)) inst74 (.A(X), .B(GRIDV21), .gr(inst74_gr));  // open: ls, eq
  REGX #(.size(10), .default_value(256)) inst83 (.clk(CLK), .data_out(GRIDV23));  // open: ld, cl, inc, dec, data_in
  CMPX #(.size(10)) inst76 (.A(Y), .B(GRIDV23), .gr(inst76_gr));  // open: ls, eq
  REGX #(.size(10), .default_value(82)) inst92 (.clk(CLK), .data_out(GRIDV31));  // open: ld, cl, inc, dec, data_in
  CMPX #(.size(10)) inst85 (.A(X), .B(GRIDV31), .gr(inst85_gr));  // open: ls, eq
  REGX #(.size(10), .default_value(341)) inst94 (.clk(CLK), .data_out(GRIDV33));  // open: ld, cl, inc, dec, data_in
  CMPX #(.size(10)) inst87 (.A(Y), .B(GRIDV33), .gr(inst87_gr));  // open: ls, eq
  REGX #(.size(10), .default_value(82)) inst103 (.clk(CLK), .data_out(GRIDV41));  // open: ld, cl, inc, dec, data_in
  CMPX #(.size(10)) inst96 (.A(X), .B(GRIDV41), .gr(inst96_gr));  // open: ls, eq
  REGX #(.size(10), .default_value(426)) inst105 (.clk(CLK), .data_out(GRIDV43));  // open: ld, cl, inc, dec, data_in
  CMPX #(.size(10)) inst98 (.A(Y), .B(GRIDV43), .gr(inst98_gr));  // open: ls, eq
  MP2X #(.size(12)) inst59 (.S(v4), .X0(inst47_y), .X1({R2, G2, B2}), .Y(inst59_y));
  or inst30 (inst30_out, 1'b0, 1'b0, v5, v6, v7, v8, v9, v10, v11, v12, 1'b0, 1'b0);
  MP2X #(.size(12)) inst60 (.S(inst30_out), .X0(inst59_y), .X1({R1, G1, B1}), .Y(inst60_y));
  MP2X #(.size(12)) inst223 (.S(v31), .X0(inst47_y), .X1({R2, G2, B2}), .Y(inst223_y));
  REGX #(.size(10), .default_value(515)) inst55 (.clk(CLK), .data_out(DOORL));  // open: ld, cl, inc, dec, data_in
  CMPX #(.size(10)) inst48 (.A(X), .B(DOORL), .gr(inst48_gr));  // open: ls, eq
  REGX #(.size(10), .default_value(257)) inst57 (.clk(CLK), .data_out(DOORU));  // open: ld, cl, inc, dec, data_in
  CMPX #(.size(10)) inst50 (.A(Y), .B(DOORU), .gr(inst50_gr));  // open: ls, eq
  REGX #(.size(10), .default_value(517)) inst70 (.clk(CLK), .data_out(GRIDV12));  // open: ld, cl, inc, dec, data_in
  CMPX #(.size(10)) inst64 (.A(X), .B(GRIDV12), .ls(inst64_ls));  // open: eq, gr
  REGX #(.size(10), .default_value(173)) inst72 (.clk(CLK), .data_out(GRIDV14));  // open: ld, cl, inc, dec, data_in
  CMPX #(.size(10)) inst66 (.A(Y), .B(GRIDV14), .ls(inst66_ls));  // open: eq, gr
  REGX #(.size(10), .default_value(517)) inst82 (.clk(CLK), .data_out(GRIDV22));  // open: ld, cl, inc, dec, data_in
  CMPX #(.size(10)) inst75 (.A(X), .B(GRIDV22), .ls(inst75_ls));  // open: eq, gr
  REGX #(.size(10), .default_value(258)) inst84 (.clk(CLK), .data_out(GRIDV24));  // open: ld, cl, inc, dec, data_in
  CMPX #(.size(10)) inst77 (.A(Y), .B(GRIDV24), .ls(inst77_ls));  // open: eq, gr
  REGX #(.size(10), .default_value(517)) inst93 (.clk(CLK), .data_out(GRIDV32));  // open: ld, cl, inc, dec, data_in
  CMPX #(.size(10)) inst86 (.A(X), .B(GRIDV32), .ls(inst86_ls));  // open: eq, gr
  REGX #(.size(10), .default_value(343)) inst95 (.clk(CLK), .data_out(GRIDV34));  // open: ld, cl, inc, dec, data_in
  CMPX #(.size(10)) inst88 (.A(Y), .B(GRIDV34), .ls(inst88_ls));  // open: eq, gr
  REGX #(.size(10), .default_value(517)) inst104 (.clk(CLK), .data_out(GRIDV42));  // open: ld, cl, inc, dec, data_in
  CMPX #(.size(10)) inst97 (.A(X), .B(GRIDV42), .ls(inst97_ls));  // open: eq, gr
  REGX #(.size(10), .default_value(428)) inst106 (.clk(CLK), .data_out(GRIDV44));  // open: ld, cl, inc, dec, data_in
  CMPX #(.size(10)) inst99 (.A(Y), .B(GRIDV44), .ls(inst99_ls));  // open: eq, gr
  MP2X #(.size(12)) inst224 (.S(inst32_out), .X0(inst223_y), .X1({R1, G1, B1}), .Y(inst224_y));
  or inst32 (inst32_out, 1'b0, 1'b0, v21, v22, v23, v24, v25, v26, v27, v28, v29, v30);
  and inst67 (inst67_out, inst64_ls, inst63_gr);
  and inst68 (inst68_out, inst66_ls, inst65_gr);
  and inst78 (inst78_out, inst75_ls, inst74_gr);
  and inst79 (inst79_out, inst77_ls, inst76_gr);
  and inst89 (inst89_out, inst86_ls, inst85_gr);
  and inst90 (inst90_out, inst88_ls, inst87_gr);
  and inst100 (inst100_out, inst97_ls, inst96_gr);
  and inst101 (inst101_out, inst99_ls, inst98_gr);
  and inst69 (v5, inst67_out, inst68_out);
  and inst80 (v6, inst78_out, inst79_out);
  and inst232 (inst232_out, LN0, LN1);
  and inst91 (v7, inst89_out, inst90_out);
  and inst102 (v8, inst100_out, inst101_out);
  MP2X #(.size(12)) inst231 (.S(inst228_out), .X0(inst60_y), .X1(inst224_y), .Y(inst231_y));
  or inst228 (inst228_out, inst232_out, inst233_out);
  and inst233 (inst233_out, inst230_out, LN1);
  not inst230 (inst230_out, LN0);
  REGX #(.size(10), .default_value(527)) inst56 (.clk(CLK), .data_out(DOORR));  // open: ld, cl, inc, dec, data_in
  CMPX #(.size(10)) inst49 (.A(X), .B(DOORR), .ls(inst49_ls));  // open: eq, gr
  REGX #(.size(10), .default_value(342)) inst58 (.clk(CLK), .data_out(DOORD));  // open: ld, cl, inc, dec, data_in
  CMPX #(.size(10)) inst51 (.A(Y), .B(DOORD), .ls(inst51_ls));  // open: eq, gr
  MP2X #(.size(12)) inst177 (.S(Next), .X0(inst231_y), .X1({R3, G3, B3}), .Y({R, G, B}));
  and inst141 (Next, Finnish, valid_end, inst229_out);
  and inst52 (inst52_out, inst49_ls, inst48_gr);
  and inst53 (inst53_out, inst51_ls, inst50_gr);
  REGX #(.size(10), .default_value(171)) inst227 (.clk(CLK), .data_out(GRIDH11));  // open: ld, cl, inc, dec, data_in
  CMPX #(.size(10)) inst107 (.A(X), .B(GRIDH11), .gr(inst107_gr));  // open: ls, eq
  REGX #(.size(10), .default_value(82)) inst142 (.clk(CLK), .data_out(GRIDH13));  // open: ld, cl, inc, dec, data_in
  CMPX #(.size(10)) inst109 (.A(Y), .B(GRIDH13), .gr(inst109_gr));  // open: ls, eq
  REGX #(.size(10), .default_value(256)) inst115 (.clk(CLK), .data_out(GRIDH21));  // open: ld, cl, inc, dec, data_in
  CMPX #(.size(10)) inst116 (.A(X), .B(GRIDH21), .gr(inst116_gr));  // open: ls, eq
  REGX #(.size(10), .default_value(82)) inst144 (.clk(CLK), .data_out(GRIDH23));  // open: ld, cl, inc, dec, data_in
  CMPX #(.size(10)) inst118 (.A(Y), .B(GRIDH23), .gr(inst118_gr));  // open: ls, eq
  REGX #(.size(10), .default_value(341)) inst124 (.clk(CLK), .data_out(GRIDH31));  // open: ld, cl, inc, dec, data_in
  CMPX #(.size(10)) inst125 (.A(X), .B(GRIDH31), .gr(inst125_gr));  // open: ls, eq
  REGX #(.size(10), .default_value(82)) inst146 (.clk(CLK), .data_out(GRIDH33));  // open: ld, cl, inc, dec, data_in
  CMPX #(.size(10)) inst127 (.A(Y), .B(GRIDH33), .gr(inst127_gr));  // open: ls, eq
  REGX #(.size(10), .default_value(426)) inst133 (.clk(CLK), .data_out(GRIDH41));  // open: ld, cl, inc, dec, data_in
  CMPX #(.size(10)) inst134 (.A(X), .B(GRIDH41), .gr(inst134_gr));  // open: ls, eq
  REGX #(.size(10), .default_value(82)) inst148 (.clk(CLK), .data_out(GRIDH43));  // open: ld, cl, inc, dec, data_in
  CMPX #(.size(10)) inst136 (.A(Y), .B(GRIDH43), .gr(inst136_gr));  // open: ls, eq
  not inst229 (inst229_out, inst178_out);
  and inst54 (v4, inst52_out, inst53_out);
  and inst178 (inst178_out, LN0, LN1);
  REGX #(.size(10), .default_value(173)) inst114 (.clk(CLK), .data_out(GRIDH12));  // open: ld, cl, inc, dec, data_in
  CMPX #(.size(10)) inst108 (.A(X), .B(GRIDH12), .ls(inst108_ls));  // open: eq, gr
  REGX #(.size(10), .default_value(517)) inst143 (.clk(CLK), .data_out(GRIDH14));  // open: ld, cl, inc, dec, data_in
  CMPX #(.size(10)) inst110 (.A(Y), .B(GRIDH14), .ls(inst110_ls));  // open: eq, gr
  REGX #(.size(10), .default_value(258)) inst123 (.clk(CLK), .data_out(GRIDH22));  // open: ld, cl, inc, dec, data_in
  CMPX #(.size(10)) inst117 (.A(X), .B(GRIDH22), .ls(inst117_ls));  // open: eq, gr
  REGX #(.size(10), .default_value(517)) inst145 (.clk(CLK), .data_out(GRIDH24));  // open: ld, cl, inc, dec, data_in
  CMPX #(.size(10)) inst119 (.A(Y), .B(GRIDH24), .ls(inst119_ls));  // open: eq, gr
  REGX #(.size(10), .default_value(343)) inst132 (.clk(CLK), .data_out(GRIDH32));  // open: ld, cl, inc, dec, data_in
  CMPX #(.size(10)) inst126 (.A(X), .B(GRIDH32), .ls(inst126_ls));  // open: eq, gr
  REGX #(.size(10), .default_value(517)) inst147 (.clk(CLK), .data_out(GRIDH34));  // open: ld, cl, inc, dec, data_in
  CMPX #(.size(10)) inst128 (.A(Y), .B(GRIDH34), .ls(inst128_ls));  // open: eq, gr
  REGX #(.size(10), .default_value(428)) inst140 (.clk(CLK), .data_out(GRIDH42));  // open: ld, cl, inc, dec, data_in
  CMPX #(.size(10)) inst135 (.A(X), .B(GRIDH42), .ls(inst135_ls));  // open: eq, gr
  REGX #(.size(10), .default_value(517)) inst149 (.clk(CLK), .data_out(GRIDH44));  // open: ld, cl, inc, dec, data_in
  CMPX #(.size(10)) inst137 (.A(Y), .B(GRIDH44), .ls(inst137_ls));  // open: eq, gr
  and inst111 (inst111_out, inst108_ls, inst107_gr);
  and inst112 (inst112_out, inst110_ls, inst109_gr);
  and inst120 (inst120_out, inst117_ls, inst116_gr);
  and inst121 (inst121_out, inst119_ls, inst118_gr);
  and inst129 (inst129_out, inst126_ls, inst125_gr);
  and inst130 (inst130_out, inst128_ls, inst127_gr);
  and inst138 (inst138_out, inst135_ls, inst134_gr);
  and inst150 (inst150_out, inst137_ls, inst136_gr);
  and inst113 (v9, inst111_out, inst112_out);
  and inst122 (v10, inst120_out, inst121_out);
  and inst131 (v11, inst129_out, inst130_out);
  and inst139 (v12, inst138_out, inst150_out);
  REGX #(.size(10), .default_value(650)) inst44 (
    .clk(CLK), .data_out(inst44_data_out));  // open: ld, cl, inc, dec, data_in
  CMPX #(.size(10)) inst163 (.A(X), .B(inst44_data_out), .gr(inst163_gr));  // open: ls, eq
  REGX #(.size(10), .default_value(400)) inst46 (
    .clk(CLK), .data_out(inst46_data_out));  // open: ld, cl, inc, dec, data_in
  CMPX #(.size(10)) inst171 (.A(Y), .B(inst46_data_out), .gr(inst171_gr));  // open: ls, eq
  CONSTX #(.size(10), .\const (600)) inst185 (.data(inst185_data));
  CONSTX #(.size(3), .\const (5)) inst186 (.data(inst186_data));
  REGX #(.size(10), .default_value(600)) inst198 (
    .clk(CLK), .data_out(inst198_data_out));  // open: ld, cl, inc, dec, data_in
  CMPX #(.size(10)) inst164 (.A(X), .B(inst198_data_out), .gr(inst164_gr));  // open: ls, eq
  REGX #(.size(10), .default_value(425)) inst196 (
    .clk(CLK), .data_out(inst196_data_out));  // open: ld, cl, inc, dec, data_in
  CMPX #(.size(10)) inst172 (.A(Y), .B(inst196_data_out), .gr(inst172_gr));  // open: ls, eq
  CONSTX #(.size(10), .\const (250)) inst169 (.data(inst169_data));
  CONSTX #(.size(3), .\const (4)) inst170 (.data(inst170_data));
  REGX #(.size(10), .default_value(500)) inst161 (
    .clk(CLK), .data_out(inst161_data_out));  // open: ld, cl, inc, dec, data_in
  CMPX #(.size(10)) inst180 (.A(Y), .B(inst161_data_out), .ls(inst180_ls));  // open: eq, gr
  ALU10 inst183 (.A(Y), .B(inst185_data), .opr(inst186_data), .D(inst183_d));
  ALU10 inst167 (.A(Y), .B(inst169_data), .opr(inst170_data), .D(inst167_d));
  CMPX #(.size(10)) inst182 (.A(inst183_d), .B(inst184_d), .ls(inst182_ls));  // open: eq, gr
  REGX #(.size(10), .default_value(700)) inst45 (
    .clk(CLK), .data_out(inst45_data_out));  // open: ld, cl, inc, dec, data_in
  CMPX #(.size(10)) inst165 (.A(X), .B(inst45_data_out), .ls(inst165_ls));  // open: eq, gr
  CMPX #(.size(10)) inst168 (.A(inst167_d), .B(X), .gr(inst168_gr));  // open: ls, eq
  REGX #(.size(10), .default_value(450)) inst162 (
    .clk(CLK), .data_out(inst162_data_out));  // open: ld, cl, inc, dec, data_in
  CMPX #(.size(10)) inst173 (.A(Y), .B(inst162_data_out), .ls(inst173_ls), .eq(inst173_eq), .gr(inst173_gr));
  ALU10 inst184 (.A(inst188_data), .B(X), .opr(inst187_data), .D(inst184_d));
  REGX #(.size(10), .default_value(651)) inst199 (
    .clk(CLK), .data_out(inst199_data_out));  // open: ld, cl, inc, dec, data_in
  REGX #(.size(10), .default_value(475)) inst197 (
    .clk(CLK), .data_out(inst197_data_out));  // open: ld, cl, inc, dec, data_in
  CMPX #(.size(10)) inst166 (.A(X), .B(inst199_data_out), .ls(inst166_ls));  // open: eq, gr
  CMPX #(.size(10)) inst176 (.A(Y), .B(inst197_data_out), .ls(inst176_ls));  // open: eq, gr
  or inst192 (inst192_out, inst173_eq, inst173_ls);
  and inst179 (inst179_out, inst165_ls, inst163_gr);
  or inst193 (inst193_out, inst173_gr, inst173_eq);
  CONSTX #(.size(10), .\const (550)) inst188 (.data(inst188_data));
  CONSTX #(.size(3), .\const (5)) inst187 (.data(inst187_data));
  and inst190 (inst190_out, inst166_ls, inst164_gr);
  and inst194 (inst194_out, inst176_ls, inst172_gr);
  and inst174 (inst174_out, inst192_out, inst171_gr);
  and inst181 (inst181_out, inst193_out, inst180_ls);
  and inst195 (inst195_out, inst190_out, inst194_out);
  and inst175 (inst175_out, inst179_out, inst168_gr, inst174_out);
  and inst189 (inst189_out, inst179_out, inst181_out, inst182_ls);
  or inst200 (valid_end, inst175_out, inst189_out, inst195_out);
  REGX #(.size(10), .default_value(82)) inst242 (
    .clk(CLK), .data_out(inst242_data_out));  // open: ld, cl, inc, dec, data_in
  CMPX #(.size(10)) inst235 (.A(X), .B(inst242_data_out), .gr(inst235_gr));  // open: ls, eq
  REGX #(.size(10), .default_value(153)) inst307 (
    .clk(CLK), .data_out(inst307_data_out));  // open: ld, cl, inc, dec, data_in
  CMPX #(.size(10)) inst237 (.A(Y), .B(inst307_data_out), .gr(inst237_gr));  // open: ls, eq
  REGX #(.size(10), .default_value(82)) inst251 (
    .clk(CLK), .data_out(inst251_data_out));  // open: ld, cl, inc, dec, data_in
  CMPX #(.size(10)) inst244 (.A(X), .B(inst251_data_out), .gr(inst244_gr));  // open: ls, eq
  REGX #(.size(10), .default_value(225)) inst309 (
    .clk(CLK), .data_out(inst309_data_out));  // open: ld, cl, inc, dec, data_in
  CMPX #(.size(10)) inst246 (.A(Y), .B(inst309_data_out), .gr(inst246_gr));  // open: ls, eq
  REGX #(.size(10), .default_value(82)) inst260 (
    .clk(CLK), .data_out(inst260_data_out));  // open: ld, cl, inc, dec, data_in
  CMPX #(.size(10)) inst253 (.A(X), .B(inst260_data_out), .gr(inst253_gr));  // open: ls, eq
  REGX #(.size(10), .default_value(297)) inst311 (
    .clk(CLK), .data_out(inst311_data_out));  // open: ld, cl, inc, dec, data_in
  CMPX #(.size(10)) inst255 (.A(Y), .B(inst311_data_out), .gr(inst255_gr));  // open: ls, eq
  REGX #(.size(10), .default_value(82)) inst269 (
    .clk(CLK), .data_out(inst269_data_out));  // open: ld, cl, inc, dec, data_in
  CMPX #(.size(10)) inst262 (.A(X), .B(inst269_data_out), .gr(inst262_gr));  // open: ls, eq
  REGX #(.size(10), .default_value(369)) inst313 (
    .clk(CLK), .data_out(inst313_data_out));  // open: ld, cl, inc, dec, data_in
  CMPX #(.size(10)) inst264 (.A(Y), .B(inst313_data_out), .gr(inst264_gr));  // open: ls, eq
  REGX #(.size(10), .default_value(82)) inst322 (
    .clk(CLK), .data_out(inst322_data_out));  // open: ld, cl, inc, dec, data_in
  CMPX #(.size(10)) inst315 (.A(X), .B(inst322_data_out), .gr(inst315_gr));  // open: ls, eq
  REGX #(.size(10), .default_value(441)) inst324 (
    .clk(CLK), .data_out(inst324_data_out));  // open: ld, cl, inc, dec, data_in
  CMPX #(.size(10)) inst317 (.A(Y), .B(inst324_data_out), .gr(inst317_gr));  // open: ls, eq
  REGX #(.size(10), .default_value(517)) inst243 (
    .clk(CLK), .data_out(inst243_data_out));  // open: ld, cl, inc, dec, data_in
  CMPX #(.size(10)) inst236 (.A(X), .B(inst243_data_out), .ls(inst236_ls));  // open: eq, gr
  REGX #(.size(10), .default_value(155)) inst308 (
    .clk(CLK), .data_out(inst308_data_out));  // open: ld, cl, inc, dec, data_in
  CMPX #(.size(10)) inst238 (.A(Y), .B(inst308_data_out), .ls(inst238_ls));  // open: eq, gr
  REGX #(.size(10), .default_value(517)) inst252 (
    .clk(CLK), .data_out(inst252_data_out));  // open: ld, cl, inc, dec, data_in
  CMPX #(.size(10)) inst245 (.A(X), .B(inst252_data_out), .ls(inst245_ls));  // open: eq, gr
  REGX #(.size(10), .default_value(227)) inst310 (
    .clk(CLK), .data_out(inst310_data_out));  // open: ld, cl, inc, dec, data_in
  CMPX #(.size(10)) inst247 (.A(Y), .B(inst310_data_out), .ls(inst247_ls));  // open: eq, gr
  REGX #(.size(10), .default_value(517)) inst261 (
    .clk(CLK), .data_out(inst261_data_out));  // open: ld, cl, inc, dec, data_in
  CMPX #(.size(10)) inst254 (.A(X), .B(inst261_data_out), .ls(inst254_ls));  // open: eq, gr
  REGX #(.size(10), .default_value(299)) inst312 (
    .clk(CLK), .data_out(inst312_data_out));  // open: ld, cl, inc, dec, data_in
  CMPX #(.size(10)) inst256 (.A(Y), .B(inst312_data_out), .ls(inst256_ls));  // open: eq, gr
  REGX #(.size(10), .default_value(517)) inst270 (
    .clk(CLK), .data_out(inst270_data_out));  // open: ld, cl, inc, dec, data_in
  REGX #(.size(10), .default_value(371)) inst314 (
    .clk(CLK), .data_out(inst314_data_out));  // open: ld, cl, inc, dec, data_in
  REGX #(.size(10), .default_value(517)) inst323 (
    .clk(CLK), .data_out(inst323_data_out));  // open: ld, cl, inc, dec, data_in
  CMPX #(.size(10)) inst316 (.A(X), .B(inst323_data_out), .ls(inst316_ls));  // open: eq, gr
  REGX #(.size(10), .default_value(443)) inst325 (
    .clk(CLK), .data_out(inst325_data_out));  // open: ld, cl, inc, dec, data_in
  CMPX #(.size(10)) inst318 (.A(Y), .B(inst325_data_out), .ls(inst318_ls));  // open: eq, gr
  CMPX #(.size(10)) inst263 (.A(X), .B(inst270_data_out), .ls(inst263_ls));  // open: eq, gr
  CMPX #(.size(10)) inst265 (.A(Y), .B(inst314_data_out), .ls(inst265_ls));  // open: eq, gr
  and inst239 (inst239_out, inst236_ls, inst235_gr);
  and inst240 (inst240_out, inst238_ls, inst237_gr);
  and inst248 (inst248_out, inst245_ls, inst244_gr);
  and inst249 (inst249_out, inst247_ls, inst246_gr);
  and inst257 (inst257_out, inst254_ls, inst253_gr);
  and inst258 (inst258_out, inst256_ls, inst255_gr);
  and inst266 (inst266_out, inst263_ls, inst262_gr);
  and inst267 (inst267_out, inst265_ls, inst264_gr);
  and inst319 (inst319_out, inst316_ls, inst315_gr);
  and inst320 (inst320_out, inst318_ls, inst317_gr);
  REGX #(.size(10), .default_value(515)) inst218 (
    .clk(CLK), .data_out(inst218_data_out));  // open: ld, cl, inc, dec, data_in
  CMPX #(.size(10)) inst62 (.A(X), .B(inst218_data_out), .gr(inst62_gr));  // open: ls, eq
  REGX #(.size(10), .default_value(226)) inst221 (
    .clk(CLK), .data_out(inst221_data_out));  // open: ld, cl, inc, dec, data_in
  CMPX #(.size(10)) inst210 (.A(Y), .B(inst221_data_out), .gr(inst210_gr));  // open: ls, eq
  and inst241 (v21, inst239_out, inst240_out);
  and inst250 (v22, inst248_out, inst249_out);
  and inst259 (v23, inst257_out, inst258_out);
  and inst268 (v24, inst266_out, inst267_out);
  and inst321 (v25, inst319_out, inst320_out);
  REGX #(.size(10), .default_value(527)) inst217 (
    .clk(CLK), .data_out(inst217_data_out));  // open: ld, cl, inc, dec, data_in
  CMPX #(.size(10)) inst209 (.A(X), .B(inst217_data_out), .ls(inst209_ls));  // open: eq, gr
  REGX #(.size(10), .default_value(298)) inst222 (
    .clk(CLK), .data_out(inst222_data_out));  // open: ld, cl, inc, dec, data_in
  CMPX #(.size(10)) inst211 (.A(Y), .B(inst222_data_out), .ls(inst211_ls));  // open: eq, gr
  REGX #(.size(10), .default_value(153)) inst326 (
    .clk(CLK), .data_out(inst326_data_out));  // open: ld, cl, inc, dec, data_in
  CMPX #(.size(10)) inst271 (.A(X), .B(inst326_data_out), .gr(inst271_gr));  // open: ls, eq
  REGX #(.size(10), .default_value(82)) inst298 (
    .clk(CLK), .data_out(inst298_data_out));  // open: ld, cl, inc, dec, data_in
  CMPX #(.size(10)) inst273 (.A(Y), .B(inst298_data_out), .gr(inst273_gr));  // open: ls, eq
  REGX #(.size(10), .default_value(225)) inst328 (
    .clk(CLK), .data_out(inst328_data_out));  // open: ld, cl, inc, dec, data_in
  CMPX #(.size(10)) inst278 (.A(X), .B(inst328_data_out), .gr(inst278_gr));  // open: ls, eq
  REGX #(.size(10), .default_value(82)) inst300 (
    .clk(CLK), .data_out(inst300_data_out));  // open: ld, cl, inc, dec, data_in
  CMPX #(.size(10)) inst280 (.A(Y), .B(inst300_data_out), .gr(inst280_gr));  // open: ls, eq
  REGX #(.size(10), .default_value(297)) inst330 (
    .clk(CLK), .data_out(inst330_data_out));  // open: ld, cl, inc, dec, data_in
  CMPX #(.size(10)) inst285 (.A(X), .B(inst330_data_out), .gr(inst285_gr));  // open: ls, eq
  REGX #(.size(10), .default_value(82)) inst302 (
    .clk(CLK), .data_out(inst302_data_out));  // open: ld, cl, inc, dec, data_in
  CMPX #(.size(10)) inst287 (.A(Y), .B(inst302_data_out), .gr(inst287_gr));  // open: ls, eq
  REGX #(.size(10), .default_value(369)) inst332 (
    .clk(CLK), .data_out(inst332_data_out));  // open: ld, cl, inc, dec, data_in
  CMPX #(.size(10)) inst292 (.A(X), .B(inst332_data_out), .gr(inst292_gr));  // open: ls, eq
  REGX #(.size(10), .default_value(82)) inst305 (
    .clk(CLK), .data_out(inst305_data_out));  // open: ld, cl, inc, dec, data_in
  CMPX #(.size(10)) inst294 (.A(Y), .B(inst305_data_out), .gr(inst294_gr));  // open: ls, eq
  REGX #(.size(10), .default_value(441)) inst343 (
    .clk(CLK), .data_out(inst343_data_out));  // open: ld, cl, inc, dec, data_in
  CMPX #(.size(10)) inst334 (.A(X), .B(inst343_data_out), .gr(inst334_gr));  // open: ls, eq
  REGX #(.size(10), .default_value(82)) inst341 (
    .clk(CLK), .data_out(inst341_data_out));  // open: ld, cl, inc, dec, data_in
  CMPX #(.size(10)) inst336 (.A(Y), .B(inst341_data_out), .gr(inst336_gr));  // open: ls, eq
  and inst212 (inst212_out, inst209_ls, inst62_gr);
  and inst215 (inst215_out, inst211_ls, inst210_gr);
  and inst216 (v31, inst212_out, inst215_out);
  REGX #(.size(10), .default_value(155)) inst327 (
    .clk(CLK), .data_out(inst327_data_out));  // open: ld, cl, inc, dec, data_in
  CMPX #(.size(10)) inst272 (.A(X), .B(inst327_data_out), .ls(inst272_ls));  // open: eq, gr
  REGX #(.size(10), .default_value(517)) inst299 (
    .clk(CLK), .data_out(inst299_data_out));  // open: ld, cl, inc, dec, data_in
  CMPX #(.size(10)) inst274 (.A(Y), .B(inst299_data_out), .ls(inst274_ls));  // open: eq, gr
  REGX #(.size(10), .default_value(227)) inst329 (
    .clk(CLK), .data_out(inst329_data_out));  // open: ld, cl, inc, dec, data_in
  CMPX #(.size(10)) inst279 (.A(X), .B(inst329_data_out), .ls(inst279_ls));  // open: eq, gr
  REGX #(.size(10), .default_value(517)) inst301 (
    .clk(CLK), .data_out(inst301_data_out));  // open: ld, cl, inc, dec, data_in
  CMPX #(.size(10)) inst281 (.A(Y), .B(inst301_data_out), .ls(inst281_ls));  // open: eq, gr
  REGX #(.size(10), .default_value(299)) inst331 (
    .clk(CLK), .data_out(inst331_data_out));  // open: ld, cl, inc, dec, data_in
  REGX #(.size(10), .default_value(517)) inst303 (
    .clk(CLK), .data_out(inst303_data_out));  // open: ld, cl, inc, dec, data_in
  CMPX #(.size(10)) inst286 (.A(X), .B(inst331_data_out), .ls(inst286_ls));  // open: eq, gr
  CMPX #(.size(10)) inst288 (.A(Y), .B(inst303_data_out), .ls(inst288_ls));  // open: eq, gr
  REGX #(.size(10), .default_value(371)) inst333 (
    .clk(CLK), .data_out(inst333_data_out));  // open: ld, cl, inc, dec, data_in
  CMPX #(.size(10)) inst293 (.A(X), .B(inst333_data_out), .ls(inst293_ls));  // open: eq, gr
  REGX #(.size(10), .default_value(517)) inst306 (
    .clk(CLK), .data_out(inst306_data_out));  // open: ld, cl, inc, dec, data_in
  CMPX #(.size(10)) inst295 (.A(Y), .B(inst306_data_out), .ls(inst295_ls));  // open: eq, gr
  REGX #(.size(10), .default_value(443)) inst344 (
    .clk(CLK), .data_out(inst344_data_out));  // open: ld, cl, inc, dec, data_in
  CMPX #(.size(10)) inst335 (.A(X), .B(inst344_data_out), .ls(inst335_ls));  // open: eq, gr
  REGX #(.size(10), .default_value(517)) inst342 (
    .clk(CLK), .data_out(inst342_data_out));  // open: ld, cl, inc, dec, data_in
  CMPX #(.size(10)) inst337 (.A(Y), .B(inst342_data_out), .ls(inst337_ls));  // open: eq, gr
  and inst275 (inst275_out, inst272_ls, inst271_gr);
  and inst276 (inst276_out, inst274_ls, inst273_gr);
  and inst282 (inst282_out, inst279_ls, inst278_gr);
  and inst283 (inst283_out, inst281_ls, inst280_gr);
  and inst289 (inst289_out, inst286_ls, inst285_gr);
  and inst290 (inst290_out, inst288_ls, inst287_gr);
  and inst296 (inst296_out, inst293_ls, inst292_gr);
  and inst304 (inst304_out, inst295_ls, inst294_gr);
  and inst338 (inst338_out, inst335_ls, inst334_gr);
  and inst340 (inst340_out, inst337_ls, inst336_gr);
  and inst277 (v26, inst275_out, inst276_out);
  and inst284 (v27, inst282_out, inst283_out);
  and inst291 (v28, inst289_out, inst290_out);
  and inst297 (v29, inst296_out, inst304_out);
  and inst339 (v30, inst338_out, inst340_out);
endmodule
